# EAGLE design plaits_5u_rev2 (EAGLE 9.2.2)

## Sheet 1 of 5
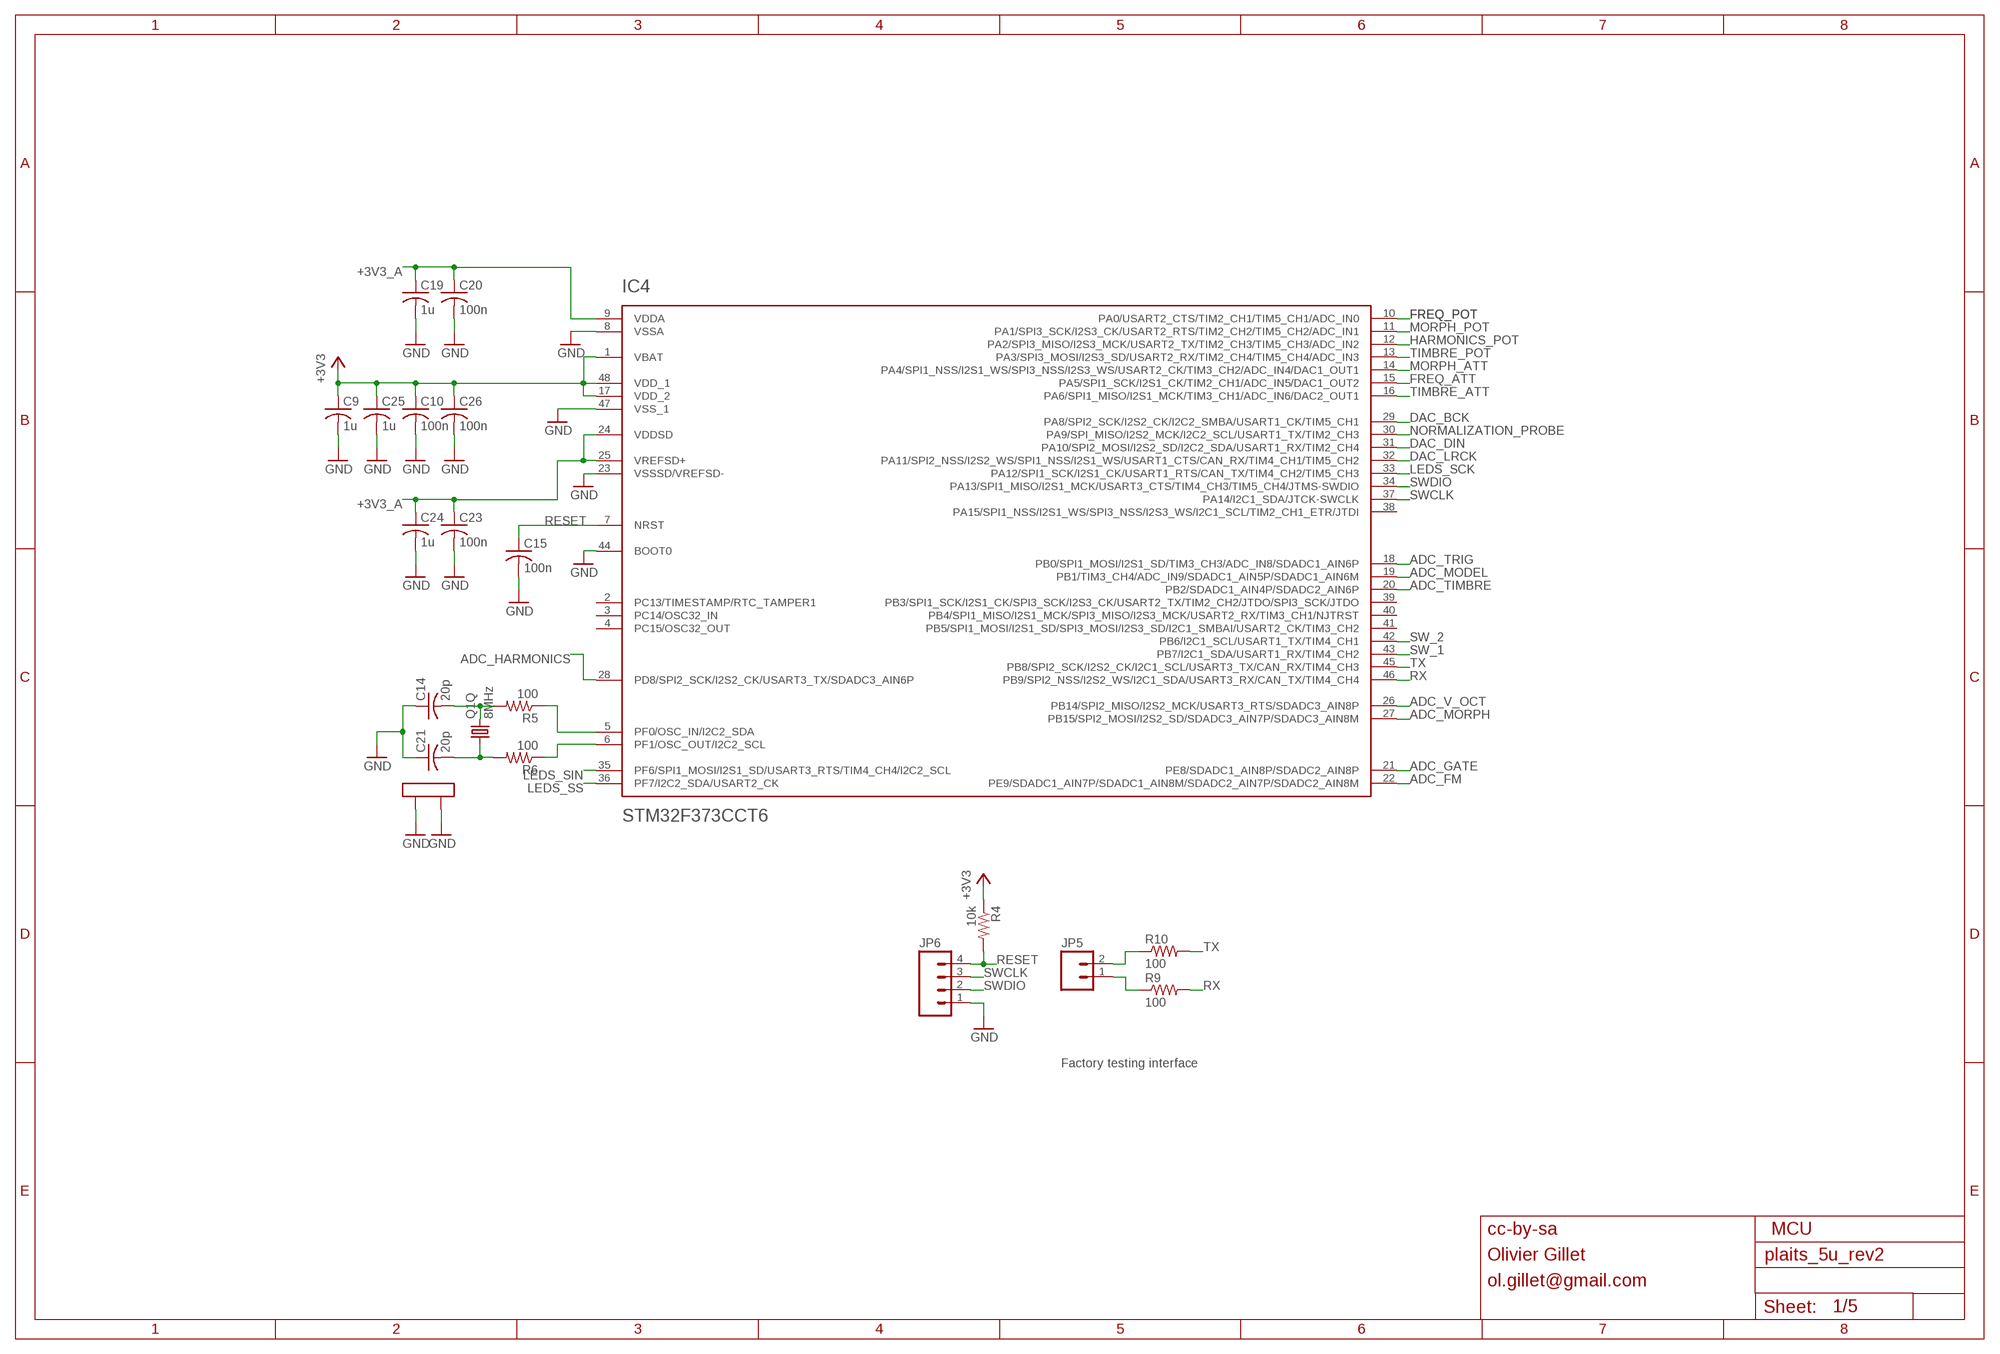
[diagram p0: schematic, sheet 1]

### Parts
C9  1u  C-USC0805  [C0805]
C10  100n  C-USC0805  [C0805]
C14  20p  C-USC0805  [C0805]
C15  100n  C-USC0805  [C0805]
C19  1u  C-USC0805  [C0805]
C20  100n  C-USC0805  [C0805]
C21  20p  C-USC0805  [C0805]
C23  100n  C-USC0805  [C0805]
C24  1u  C-USC0805  [C0805]
C25  1u  C-USC0805  [C0805]
C26  100n  C-USC0805  [C0805]
IC4  STM32F373CCT6  STM32F373C  [LQFP48]
JP5  M02PTH  [1X02]
JP6  M04PTH  [1X04]
Q1  8MHz  CRYSTAL  [CTS406]
R4  10k  R-US_R0805  [R0805]
R5  100  R-US_R0805  [R0805]
R6  100  R-US_R0805  [R0805]
R9  100  R-US_R0805  [R0805]
R10  100  R-US_R0805  [R0805]

### Nets
+3V3: C9.1 C10.1 C25.1 C26.1 IC4.1(VBAT) IC4.17(VDD_2) IC4.48(VDD_1) R4.1 ; also sheet 2,3,4,5
+3V3_A: C19.1 C20.1 C23.1 C24.1 IC4.9(VDDA) IC4.24(VDDSD) IC4.25(VREFSD+) ; also sheet 2,3,4,5
ADC_FM: IC4.22(PE9/SDADC1_AIN7P/SDADC1_AIN8M/SDADC2_AIN7P/SDADC2_AIN8M) ; also sheet 3
ADC_GATE: IC4.21(PE8/SDADC1_AIN8P/SDADC2_AIN8P) ; also sheet 3
ADC_HARMONICS: IC4.28(PD8/SPI2_SCK/I2S2_CK/USART3_TX/SDADC3_AIN6P) ; also sheet 3
ADC_MODEL: IC4.19(PB1/TIM3_CH4/ADC_IN9/SDADC1_AIN5P/SDADC1_AIN6M) ; also sheet 3
ADC_MORPH: IC4.27(PB15/SPI2_MOSI/I2S2_SD/SDADC3_AIN7P/SDADC3_AIN8M) ; also sheet 3
ADC_TIMBRE: IC4.20(PB2/SDADC1_AIN4P/SDADC2_AIN6P) ; also sheet 3
ADC_TRIG: IC4.18(PB0/SPI1_MOSI/I2S1_SD/TIM3_CH3/ADC_IN8/SDADC1_AIN6P) ; also sheet 3
ADC_V_OCT: IC4.26(PB14/SPI2_MISO/I2S2_MCK/USART3_RTS/SDADC3_AIN8P) ; also sheet 3
DAC_BCK: IC4.29(PA8/SPI2_SCK/I2S2_CK/I2C2_SMBA/USART1_CK/TIM5_CH1) ; also sheet 4
DAC_DIN: IC4.31(PA10/SPI2_MOSI/I2S2_SD/I2C2_SDA/USART1_RX/TIM2_CH4) ; also sheet 4
DAC_LRCK: IC4.32(PA11/SPI2_NSS/I2S2_WS/SPI1_NSS/I2S1_WS/USART1_CTS/CAN_RX/TIM4_CH1/TIM5_CH2) ; also sheet 4
FREQ_ATT: IC4.15(PA5/SPI1_SCK/I2S1_CK/TIM2_CH1/ADC_IN5/DAC1_OUT2) ; also sheet 2
FREQ_POT: IC4.10(PA0/USART2_CTS/TIM2_CH1/TIM5_CH1/ADC_IN0) ; also sheet 2
GND: C9.2 C10.2 C14.1 C15.2 C19.2 C20.2 C21.1 C23.2 C24.2 C25.2 C26.2 IC4.8(VSSA) IC4.23(VSSSD/VREFSD-) IC4.44(BOOT0) IC4.47(VSS_1) JP6.1 Q1.2(LID1) Q1.4(LID2) ; also sheet 2,3,4,5
HARMONICS_POT: IC4.12(PA2/SPI3_MISO/I2S3_MCK/USART2_TX/TIM2_CH3/TIM5_CH3/ADC_IN2) ; also sheet 2
LEDS_SCK: IC4.33(PA12/SPI1_SCK/I2S1_CK/USART1_RTS/CAN_TX/TIM4_CH2/TIM5_CH3) ; also sheet 2
LEDS_SIN: IC4.35(PF6/SPI1_MOSI/I2S1_SD/USART3_RTS/TIM4_CH4/I2C2_SCL) ; also sheet 2
LEDS_SS: IC4.36(PF7/I2C2_SDA/USART2_CK) ; also sheet 2
MORPH_ATT: IC4.14(PA4/SPI1_NSS/I2S1_WS/SPI3_NSS/I2S3_WS/USART2_CK/TIM3_CH2/ADC_IN4/DAC1_OUT1) ; also sheet 2
MORPH_POT: IC4.11(PA1/SPI3_SCK/I2S3_CK/USART2_RTS/TIM2_CH2/TIM5_CH2/ADC_IN1) ; also sheet 2
N$7: IC4.5(PF0/OSC_IN/I2C2_SDA) R5.1
N$8: IC4.6(PF1/OSC_OUT/I2C2_SCL) R6.1
N$29: C14.2 Q1.3 R5.2
N$33: JP5.2 R10.1
N$35: C21.2 Q1.1 R6.2
N$51: JP5.1 R9.1
NORMALIZATION_PROBE: IC4.30(PA9/SPI_MISO/I2S2_MCK/I2C2_SCL/USART1_TX/TIM2_CH3) ; also sheet 3
RESET: C15.1 IC4.7(NRST) JP6.4 R4.2
RX: IC4.46(PB9/SPI2_NSS/I2S2_WS/I2C1_SDA/USART3_RX/CAN_TX/TIM4_CH4) R9.2
SW_1: IC4.43(PB7/I2C1_SDA/USART1_RX/TIM4_CH2) ; also sheet 2
SW_2: IC4.42(PB6/I2C1_SCL/USART1_TX/TIM4_CH1) ; also sheet 2
SWCLK: IC4.37(PA14/I2C1_SDA/JTCK-SWCLK) JP6.3
SWDIO: IC4.34(PA13/SPI1_MISO/I2S1_MCK/USART3_CTS/TIM4_CH3/TIM5_CH4/JTMS-SWDIO) JP6.2
TIMBRE_ATT: IC4.16(PA6/SPI1_MISO/I2S1_MCK/TIM3_CH1/ADC_IN6/DAC2_OUT1) ; also sheet 2
TIMBRE_POT: IC4.13(PA3/SPI3_MOSI/I2S3_SD/USART2_RX/TIM2_CH4/TIM5_CH4/ADC_IN3) ; also sheet 2
TX: IC4.45(PB8/SPI2_SCK/I2S2_CK/I2C1_SCL/USART3_TX/CAN_RX/TIM4_CH3) R10.2
Unconnected: IC4.2(PC13/TIMESTAMP/RTC_TAMPER1) IC4.3(PC14/OSC32_IN) IC4.4(PC15/OSC32_OUT) IC4.38(PA15/SPI1_NSS/I2S1_WS/SPI3_NSS/I2S3_WS/I2C1_SCL/TIM2_CH1_ETR/JTDI) IC4.39(PB3/SPI1_SCK/I2S1_CK/SPI3_SCK/I2S3_CK/USART2_TX/TIM2_CH2/JTDO/SPI3_SCK/JTDO) IC4.40(PB4/SPI1_MISO/I2S1_MCK/SPI3_MISO/I2S3_MCK/USART2_RX/TIM3_CH1/NJTRST) IC4.41(PB5/SPI1_MOSI/I2S1_SD/SPI3_MOSI/I2S3_SD/I2C1_SMBAI/USART2_CK/TIM3_CH2)

### Notes on the sheet
- Factory testing interface
- cc-by-sa | MCU
- Olivier Gillet
- ol.gillet@gmail.com

## Sheet 2 of 5
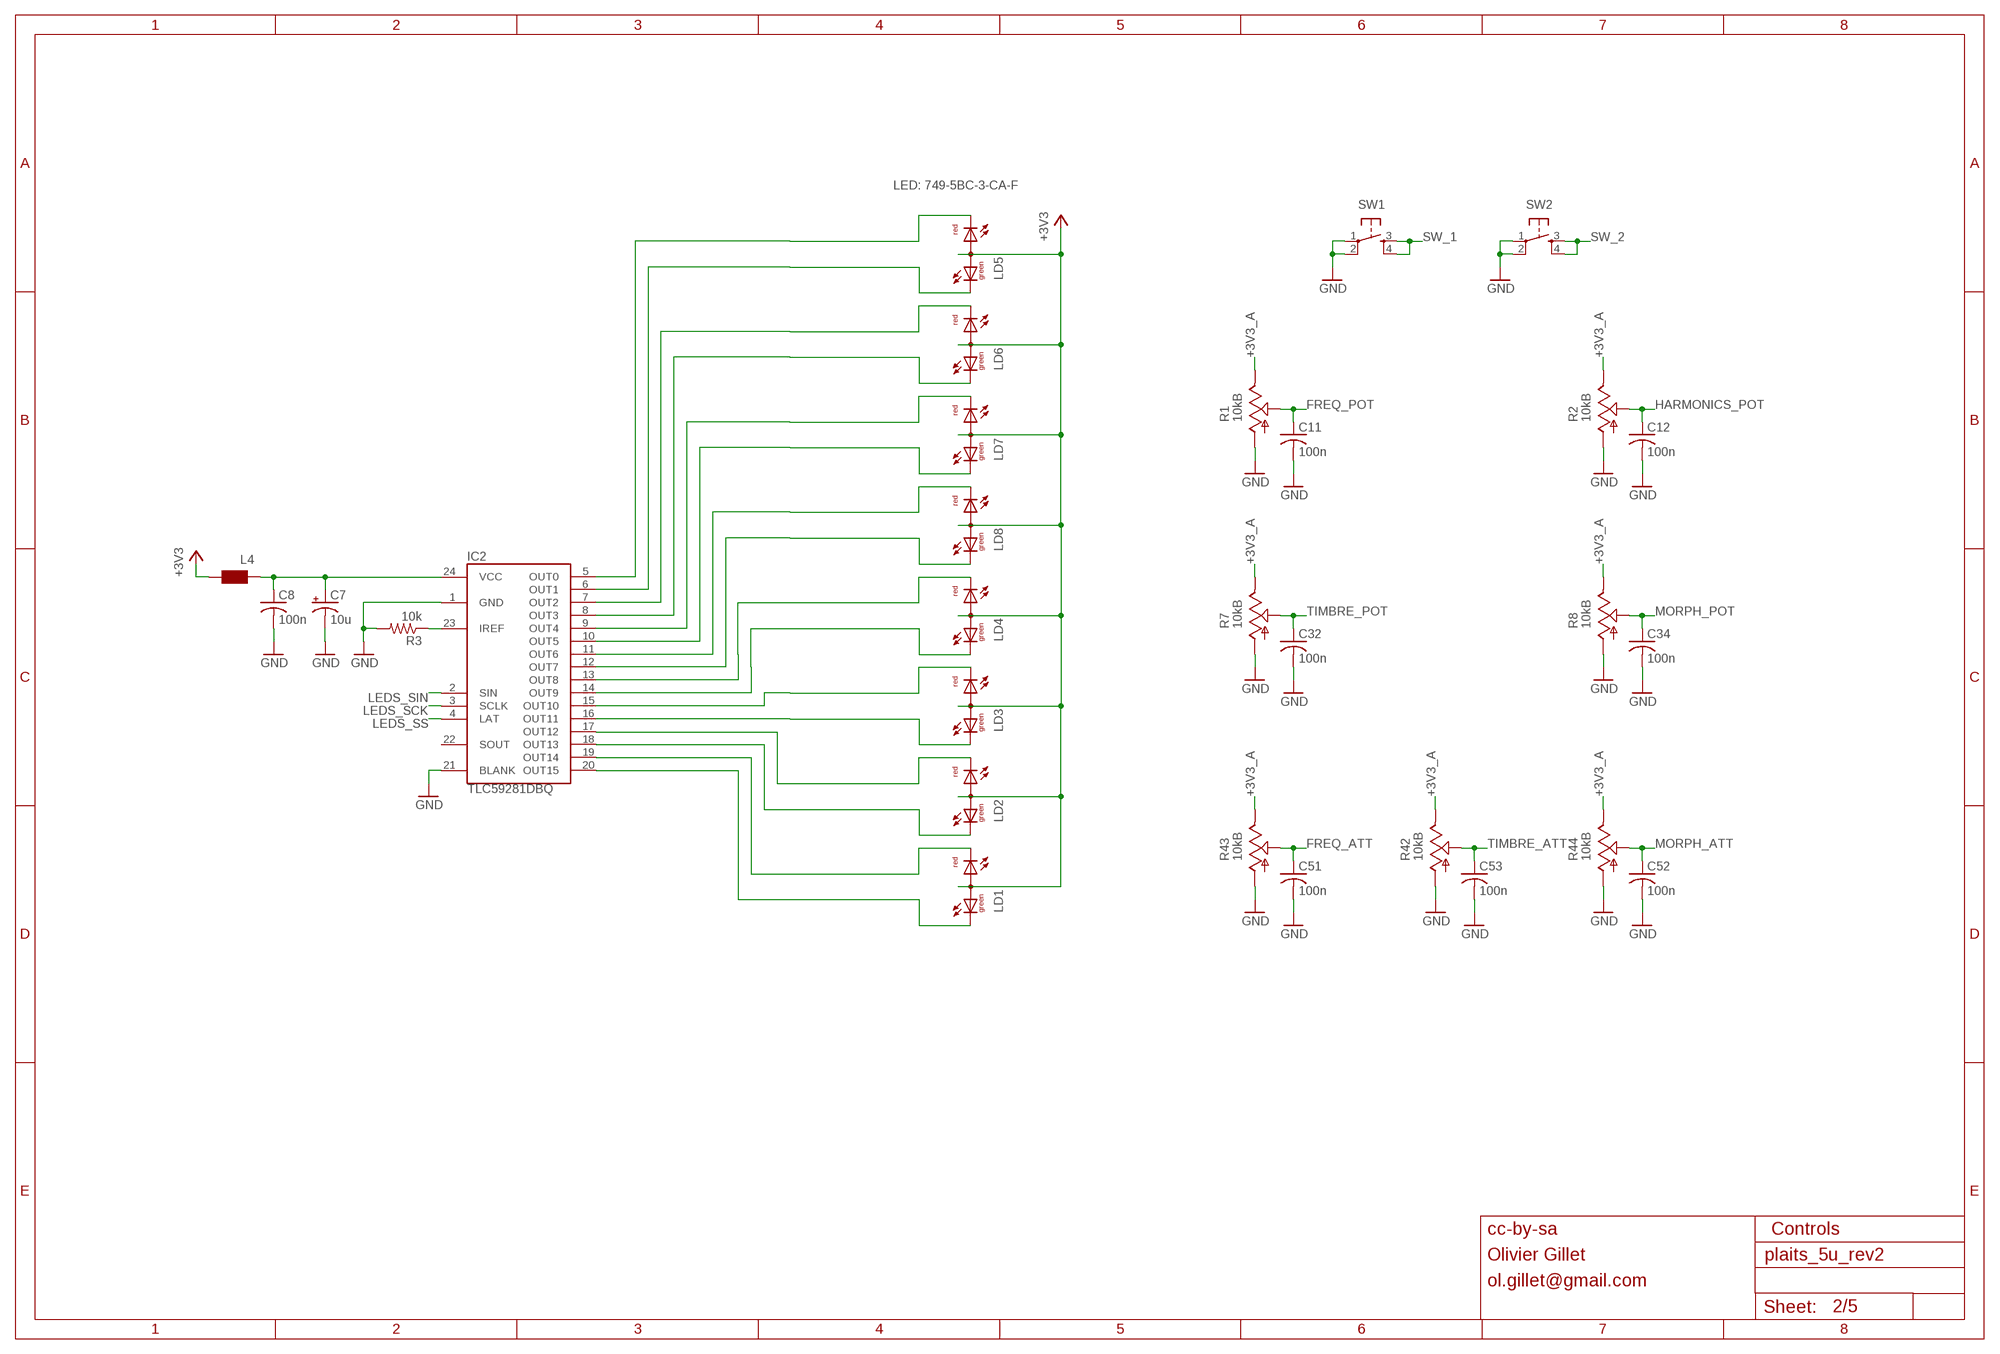
[diagram p1: schematic, sheet 2]

### Parts
C7  10u  CPOL-USA  [PANASONIC_A]
C8  100n  C-USC0805  [C0805]
C11  100n  C-USC0805  [C0805]
C12  100n  C-USC0805  [C0805]
C32  100n  C-USC0805  [C0805]
C34  100n  C-USC0805  [C0805]
C51  100n  C-USC0805  [C0805]
C52  100n  C-USC0805  [C0805]
C53  100n  C-USC0805  [C0805]
IC2  TLC59281DBQ  [TSSOP24_0635]
L4  WE-CBF_0805  [0805]
LD1  DUOLED-RG-A  [DUOLED-A-5MM]
LD2  DUOLED-RG-A  [DUOLED-A-5MM]
LD3  DUOLED-RG-A  [DUOLED-A-5MM]
LD4  DUOLED-RG-A  [DUOLED-A-5MM]
LD5  DUOLED-RG-A  [DUOLED-A-5MM]
LD6  DUOLED-RG-A  [DUOLED-A-5MM]
LD7  DUOLED-RG-A  [DUOLED-A-5MM]
LD8  DUOLED-RG-A  [DUOLED-A-5MM]
R1  10kB  POT_USVERTICAL_PS  [ALPS_POT_VERTICAL_PS]
R2  10kB  POT_USVERTICAL_PS  [ALPS_POT_VERTICAL_PS]
R3  10k  R-US_R0805  [R0805]
R7  10kB  POT_USVERTICAL_PS  [ALPS_POT_VERTICAL_PS]
R8  10kB  POT_USVERTICAL_PS  [ALPS_POT_VERTICAL_PS]
R42  10kB  POT_USVERTICAL  [ALPS_POT_VERTICAL]
R43  10kB  POT_USVERTICAL  [ALPS_POT_VERTICAL]
R44  10kB  POT_USVERTICAL  [ALPS_POT_VERTICAL]
SW1  TAC_SWITCHPTH  [TACTILE-PTH]
SW2  TAC_SWITCHPTH  [TACTILE-PTH]

### Nets
+3V3: L4.2 LD1.A LD2.A LD3.A LD4.A LD5.A LD6.A LD7.A LD8.A ; also sheet 1,3,4,5
+3V3_A: R1.P$1(E) R2.P$1(E) R7.P$1(E) R8.P$1(E) R42.P$1(E) R43.P$1(E) R44.P$1(E) ; also sheet 1,3,4,5
FREQ_ATT: C51.1 R43.P$2(S) ; also sheet 1
FREQ_POT: C11.1 R1.P$2(S) ; also sheet 1
GND: C7.- C8.2 C11.2 C12.2 C32.2 C34.2 C51.2 C52.2 C53.2 IC2.1(GND) IC2.21(BLANK) R1.P$3(A) R2.P$3(A) R3.2 R7.P$3(A) R8.P$3(A) R42.P$3(A) R43.P$3(A) R44.P$3(A) SW1.1 SW1.2 SW2.1 SW2.2 ; also sheet 1,3,4,5
HARMONICS_POT: C12.1 R2.P$2(S) ; also sheet 1
LEDS_SCK: IC2.3(SCLK) ; also sheet 1
LEDS_SIN: IC2.2(SIN) ; also sheet 1
LEDS_SS: IC2.4(LAT) ; also sheet 1
MORPH_ATT: C52.1 R44.P$2(S) ; also sheet 1
MORPH_POT: C34.1 R8.P$2(S) ; also sheet 1
N$2: IC2.12(OUT7) LD8.CX(CG)
N$5: IC2.11(OUT6) LD8.CR
N$9: IC2.10(OUT5) LD7.CX(CG)
N$10: IC2.9(OUT4) LD7.CR
N$11: IC2.8(OUT3) LD6.CX(CG)
N$12: IC2.13(OUT8) LD4.CR
N$13: IC2.7(OUT2) LD6.CR
N$14: IC2.14(OUT9) LD4.CX(CG)
N$15: IC2.6(OUT1) LD5.CX(CG)
N$17: IC2.15(OUT10) LD3.CR
N$18: IC2.16(OUT11) LD3.CX(CG)
N$19: IC2.17(OUT12) LD2.CR
N$20: IC2.18(OUT13) LD2.CX(CG)
N$21: IC2.19(OUT14) LD1.CR
N$22: IC2.5(OUT0) LD5.CR
N$23: IC2.20(OUT15) LD1.CX(CG)
N$27: C7.+ C8.1 IC2.24(VCC) L4.1
N$68: IC2.23(IREF) R3.1
SW_1: SW1.3 SW1.4 ; also sheet 1
SW_2: SW2.3 SW2.4 ; also sheet 1
TIMBRE_ATT: C53.1 R42.P$2(S) ; also sheet 1
TIMBRE_POT: C32.1 R7.P$2(S) ; also sheet 1
Unconnected: IC2.22(SOUT)

### Notes on the sheet
- LED: 749-5BC-3-CA-F
- cc-by-sa | Controls
- Olivier Gillet
- ol.gillet@gmail.com

## Sheet 3 of 5
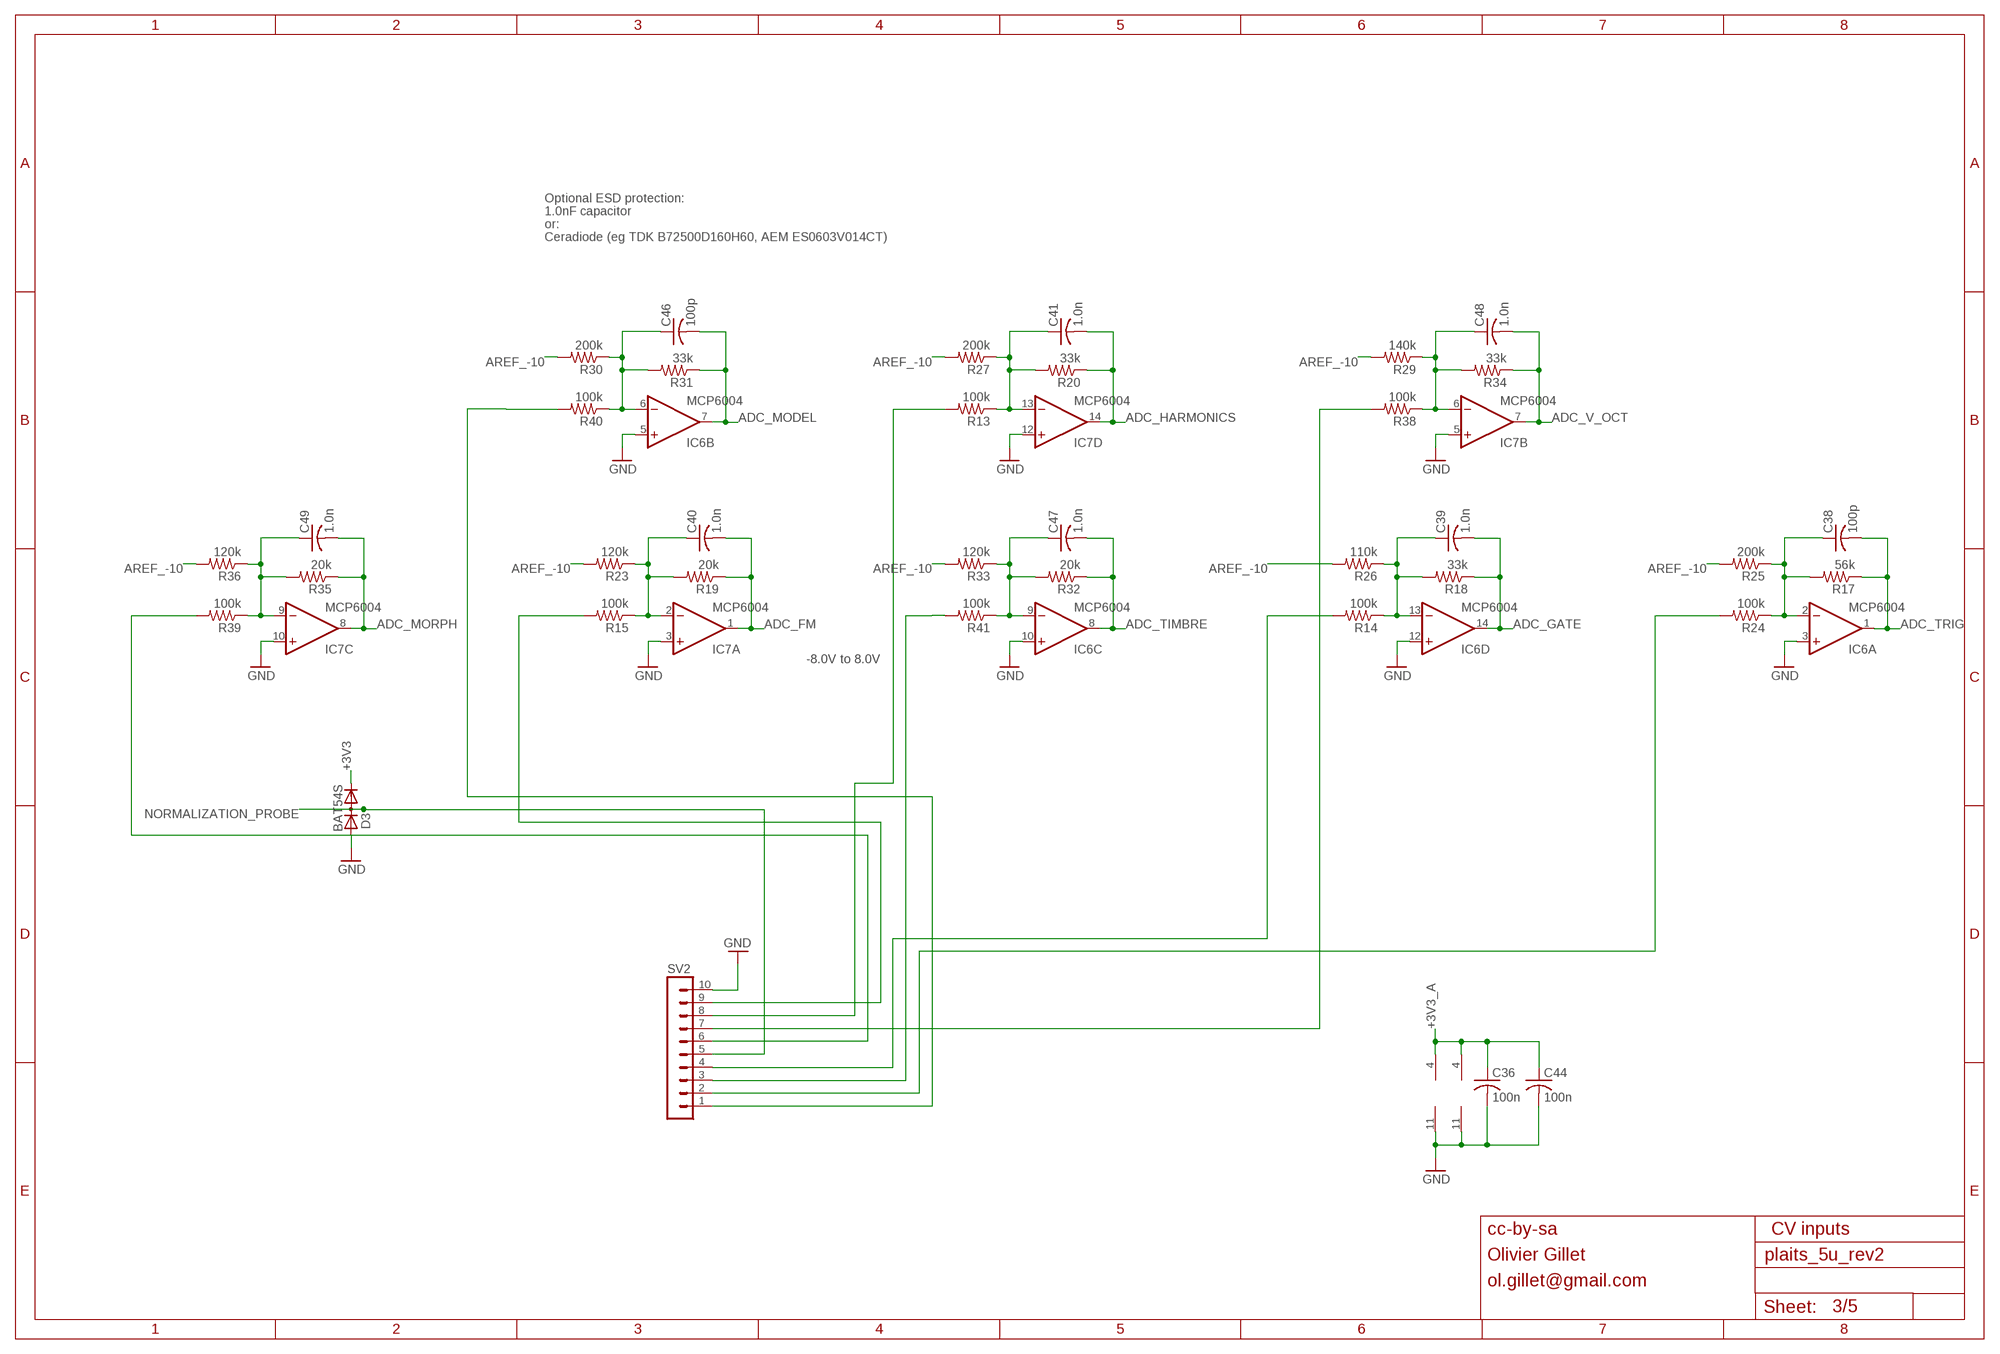
[diagram p2: schematic, sheet 3]

### Parts
C36  100n  C-USC0805  [C0805]
C38  100p  C-USC0805  [C0805]
C39  1.0n  C-USC0805  [C0805]
C40  1.0n  C-USC0805  [C0805]
C41  1.0n  C-USC0805  [C0805]
C44  100n  C-USC0805  [C0805]
C46  100p  C-USC0805  [C0805]
C47  1.0n  C-USC0805  [C0805]
C48  1.0n  C-USC0805  [C0805]
C49  1.0n  C-USC0805  [C0805]
D3  BAT54S  DIODE_2CACA-SOT23  [SOT23]
IC6  MCP6004  TL074D  [SO14]
IC7  MCP6004  TL074D  [SO14]
R13  100k  R-US_R0805  [R0805]
R14  100k  R-US_R0805  [R0805]
R15  100k  R-US_R0805  [R0805]
R17  56k  R-US_R0805  [R0805]
R18  33k  R-US_R0805  [R0805]
R19  20k  R-US_R0805  [R0805]
R20  33k  R-US_R0805  [R0805]
R23  120k  R-US_R0805  [R0805]
R24  100k  R-US_R0805  [R0805]
R25  200k  R-US_R0805  [R0805]
R26  110k  R-US_R0805  [R0805]
R27  200k  R-US_R0805  [R0805]
R29  140k  R-US_R0805  [R0805]
R30  200k  R-US_R0805  [R0805]
R31  33k  R-US_R0805  [R0805]
R32  20k  R-US_R0805  [R0805]
R33  120k  R-US_R0805  [R0805]
R34  33k  R-US_R0805  [R0805]
R35  20k  R-US_R0805  [R0805]
R36  120k  R-US_R0805  [R0805]
R38  100k  R-US_R0805  [R0805]
R39  100k  R-US_R0805  [R0805]
R40  100k  R-US_R0805  [R0805]
R41  100k  R-US_R0805  [R0805]
SV2  MA10-1  [MA10-1]

### Nets
+3V3: D3.2(C) ; also sheet 1,2,4,5
+3V3_A: C36.1 C44.1 IC6.4(P:V+) IC7.4(P:V+) ; also sheet 1,2,4,5
ADC_FM: C40.2 IC7.1(A:OUT) R19.1 ; also sheet 1
ADC_GATE: C39.2 IC6.14(D:OUT) R18.1 ; also sheet 1
ADC_HARMONICS: C41.2 IC7.14(D:OUT) R20.1 ; also sheet 1
ADC_MODEL: C46.2 IC6.7(B:OUT) R31.1 ; also sheet 1
ADC_MORPH: C49.2 IC7.8(C:OUT) R35.1 ; also sheet 1
ADC_TIMBRE: C47.2 IC6.8(C:OUT) R32.1 ; also sheet 1
ADC_TRIG: C38.2 IC6.1(A:OUT) R17.1 ; also sheet 1
ADC_V_OCT: C48.2 IC7.7(B:OUT) R34.1 ; also sheet 1
AREF_-10: R23.2 R25.2 R26.2 R27.2 R29.2 R30.2 R33.2 R36.2 ; also sheet 5
FM_IN: R15.2 SV2.9
GATE_IN: R14.2 SV2.4
GATE_IN1: R24.2 SV2.2
GND: C36.2 C44.2 D3.1(A) IC6.3(A:+IN) IC6.5(B:+IN) IC6.10(C:+IN) IC6.11(P:V-) IC6.12(D:+IN) IC7.3(A:+IN) IC7.5(B:+IN) IC7.10(C:+IN) IC7.11(P:V-) IC7.12(D:+IN) SV2.10 ; also sheet 1,2,4,5
HARMONICS_IN: R13.2 SV2.8
MODEL_IN: R40.2 SV2.1
MORPH_IN: R39.2 SV2.6
N$4: C38.1 IC6.2(A:-IN) R17.2 R24.1 R25.1
N$28: C39.1 IC6.13(D:-IN) R14.1 R18.2 R26.1
N$30: C48.1 IC7.6(B:-IN) R29.1 R34.2 R38.1
N$31: R41.2 SV2.3
N$32: C49.1 IC7.9(C:-IN) R35.2 R36.1 R39.1
N$34: C40.1 IC7.2(A:-IN) R15.1 R19.2 R23.1
N$37: C46.1 IC6.6(B:-IN) R30.1 R31.2 R40.1
N$39: C47.1 IC6.9(C:-IN) R32.2 R33.1 R41.1
N$41: C41.1 IC7.13(D:-IN) R13.1 R20.2 R27.1
NORMALIZATION_PROBE: D3.3(AC) SV2.5 ; also sheet 1
V_OCT_IN: R38.2 SV2.7

### Notes on the sheet
- Optional ESD protection:
- 1.0nF capacitor
- or:
- Ceradiode (eg TDK B72500D160H60, AEM ES0603V014CT)
- -8.0V to 8.0V
- cc-by-sa | CV inputs
- Olivier Gillet
- ol.gillet@gmail.com

## Sheet 4 of 5
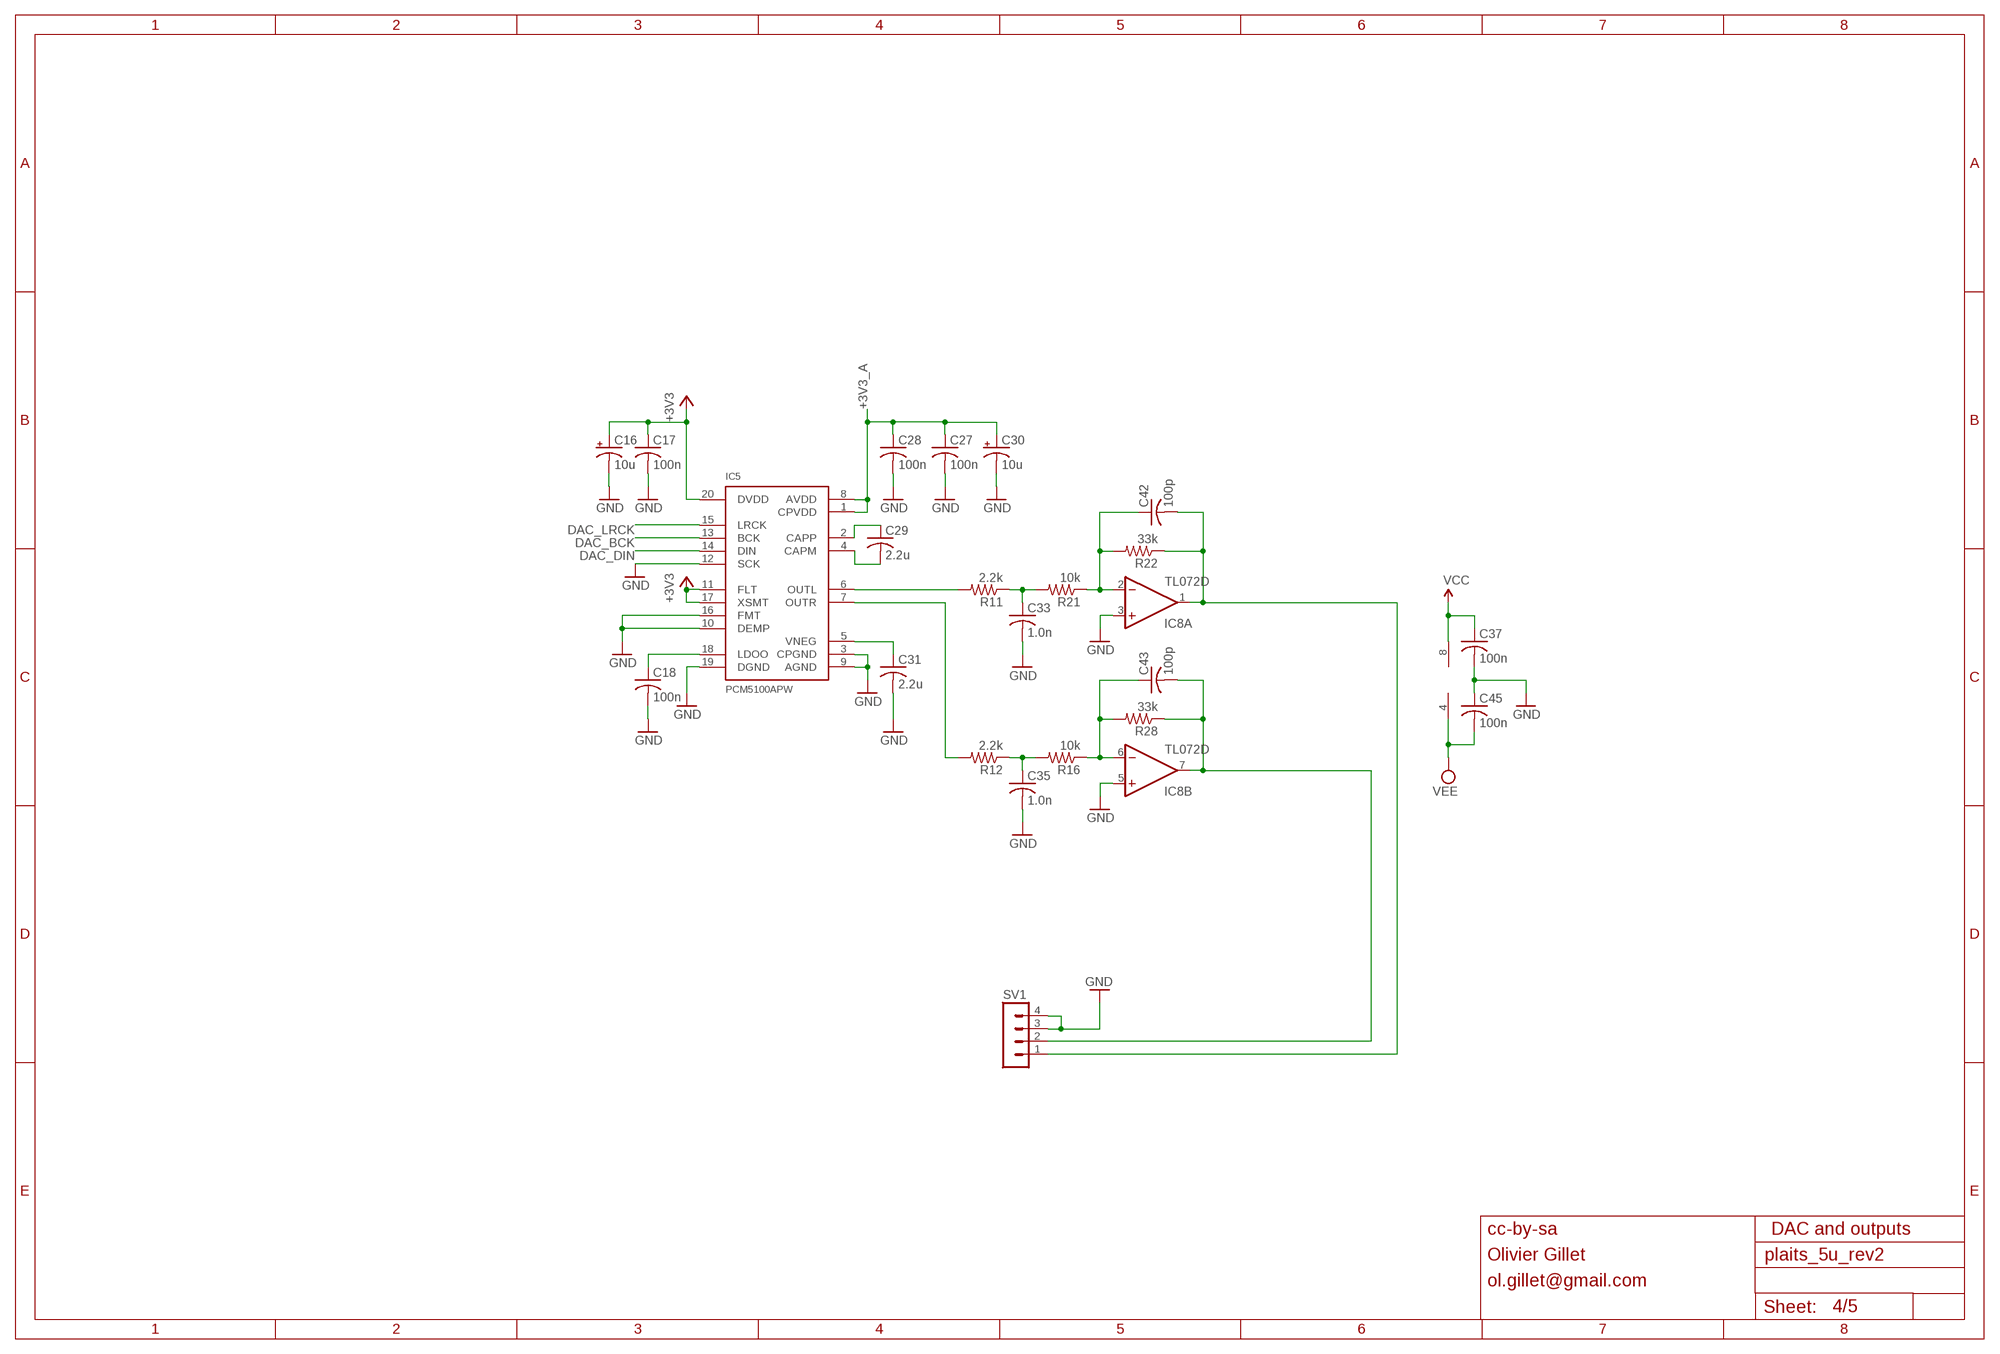
[diagram p3: schematic, sheet 4]

### Parts
C16  10u  CPOL-USA  [PANASONIC_A]
C17  100n  C-USC0805  [C0805]
C18  100n  C-USC0805  [C0805]
C27  100n  C-USC0805  [C0805]
C28  100n  C-USC0805  [C0805]
C29  2.2u  C-USC0805  [C0805]
C30  10u  CPOL-USA  [PANASONIC_A]
C31  2.2u  C-USC0805  [C0805]
C33  1.0n  C-USC0805  [C0805]
C35  1.0n  C-USC0805  [C0805]
C37  100n  C-USC0805  [C0805]
C42  100p  C-USC0805  [C0805]
C43  100p  C-USC0805  [C0805]
C45  100n  C-USC0805  [C0805]
IC5  PCM5100APW  PCM5100PW  [SSOP20]
IC8  TL072D  [SO08]
R11  2.2k  R-US_R0805  [R0805]
R12  2.2k  R-US_R0805  [R0805]
R16  10k  R-US_R0805  [R0805]
R21  10k  R-US_R0805  [R0805]
R22  33k  R-US_R0805  [R0805]
R28  33k  R-US_R0805  [R0805]
SV1  MA04-1  [MA04-1]

### Nets
+3V3: C16.+ C17.1 IC5.11(FLT) IC5.17(XSMT) IC5.20(DVDD) ; also sheet 1,2,3,5
+3V3_A: C27.1 C28.1 C30.+ IC5.1(CPVDD) IC5.8(AVDD) ; also sheet 1,2,3,5
DAC_BCK: IC5.13(BCK) ; also sheet 1
DAC_DIN: IC5.14(DIN) ; also sheet 1
DAC_LRCK: IC5.15(LRCK) ; also sheet 1
GND: C16.- C17.2 C18.2 C27.2 C28.2 C30.- C31.2 C33.2 C35.2 C37.2 C45.1 IC5.3(CPGND) IC5.9(AGND) IC5.10(DEMP) IC5.12(SCK) IC5.16(FMT) IC5.19(DGND) IC8.3(A:+IN) IC8.5(B:+IN) SV1.3 SV1.4 ; also sheet 1,2,3,5
N$6: C29.1 IC5.2(CAPP)
N$16: C29.2 IC5.4(CAPM)
N$43: IC5.6(OUTL) R11.2
N$46: C33.1 R11.1 R21.2
N$47: C35.1 R12.1 R16.2
N$48: C31.1 IC5.5(VNEG)
N$54: C18.1 IC5.18(LDOO)
N$55: IC5.7(OUTR) R12.2
N$58: C43.1 IC8.6(B:-IN) R16.1 R28.2
N$60: C43.2 IC8.7(B:OUT) R28.1 SV1.2
N$62: C42.1 IC8.2(A:-IN) R21.1 R22.2
N$63: C42.2 IC8.1(A:OUT) R22.1 SV1.1
VCC: C37.1 IC8.8(P:V+) ; also sheet 5
VEE: C45.2 IC8.4(P:V-) ; also sheet 5

### Notes on the sheet
- cc-by-sa | DAC and outputs
- Olivier Gillet
- ol.gillet@gmail.com

## Sheet 5 of 5
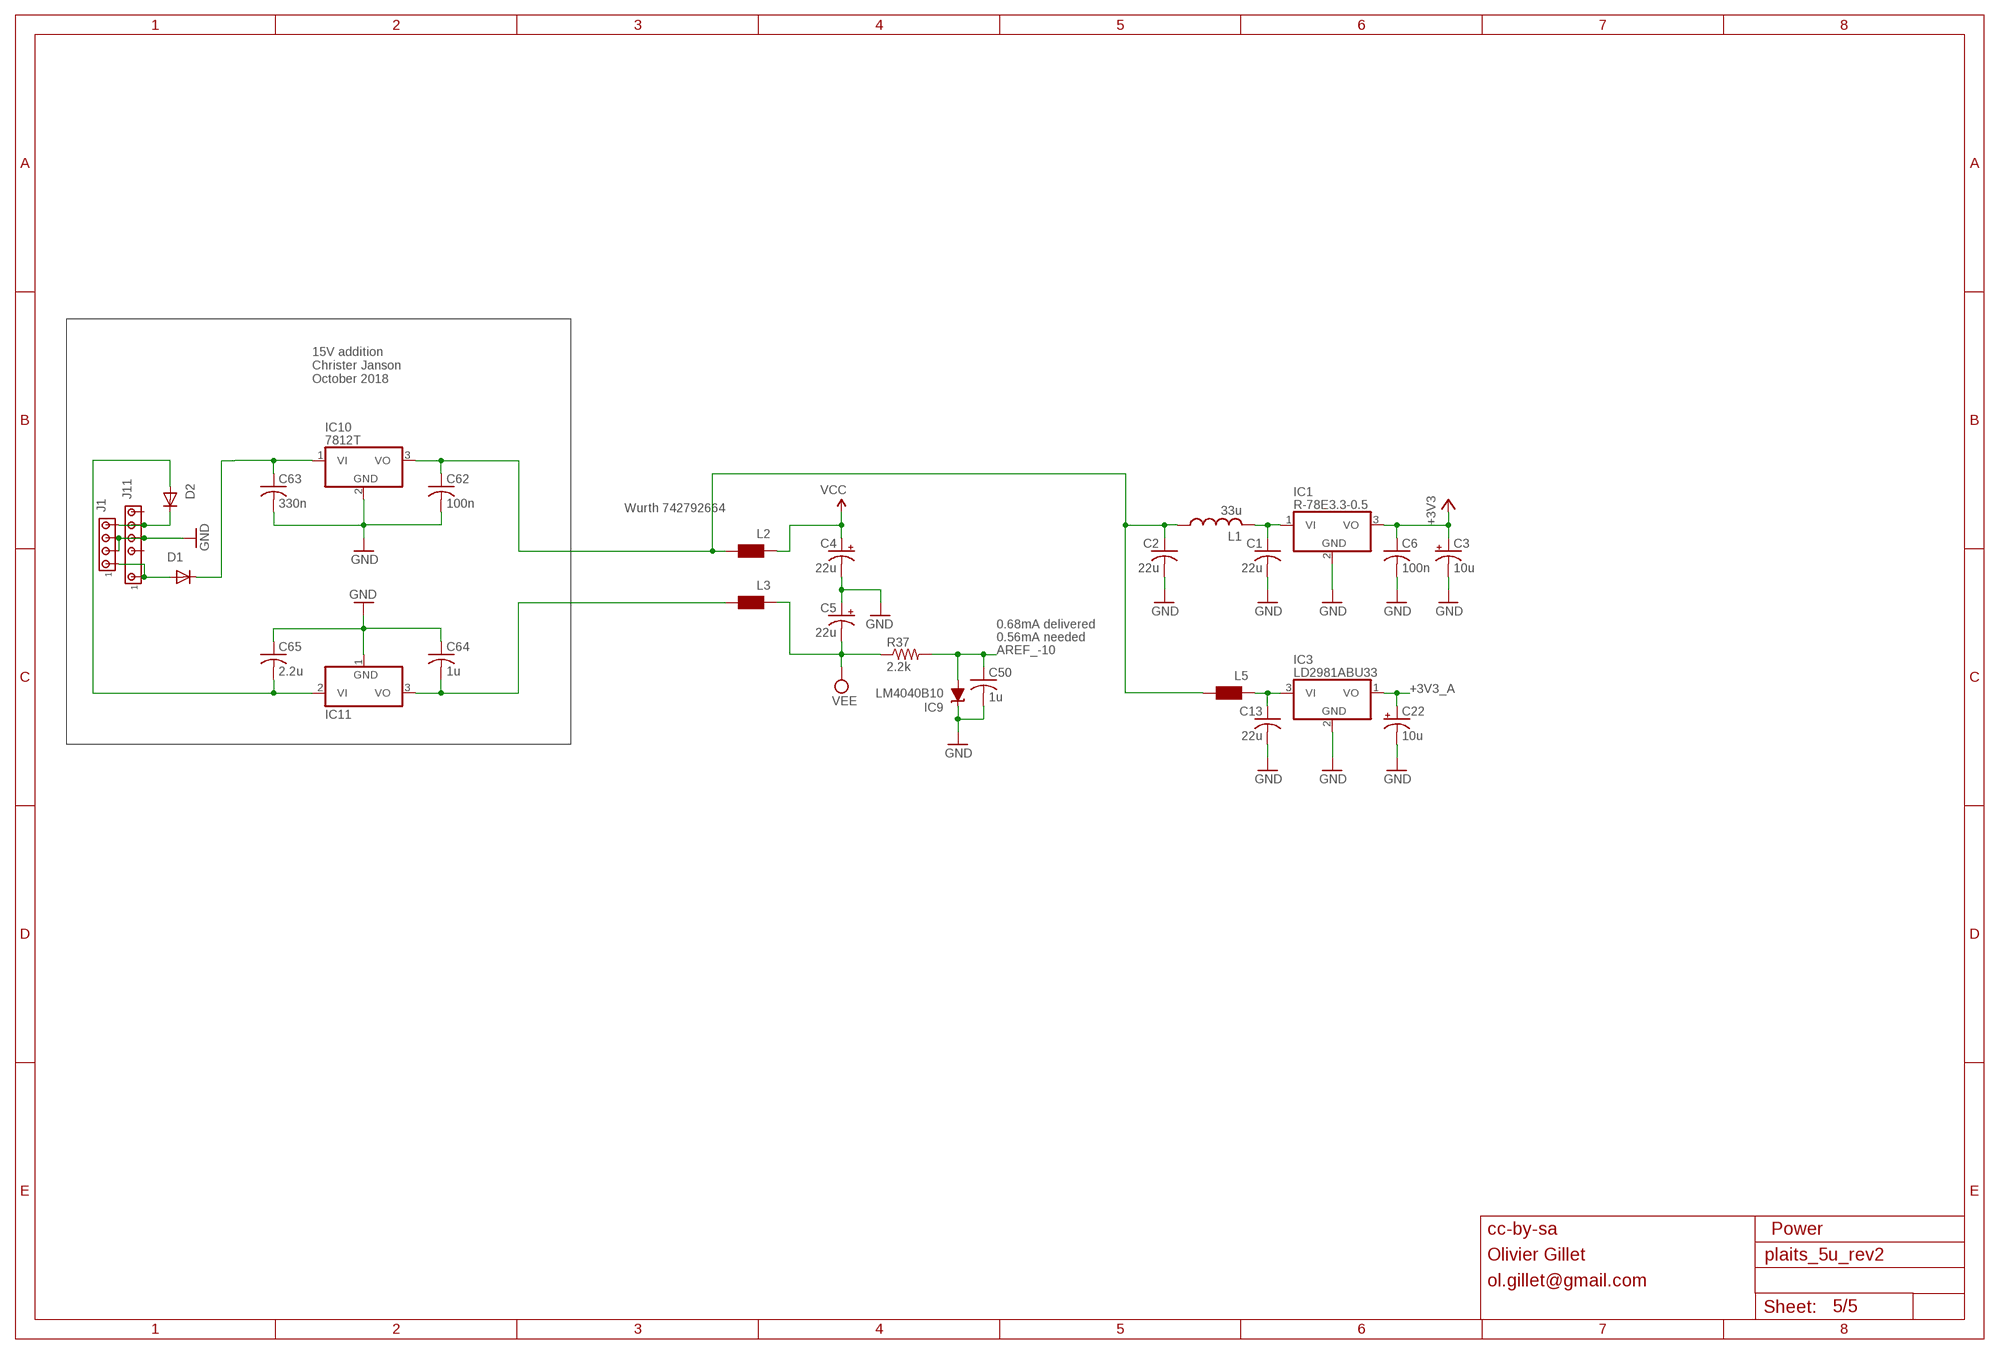
[diagram p4: schematic, sheet 5]

### Parts
C1  22u  C-USC1206  [C1206]
C2  22u  C-USC1206  [C1206]
C3  10u  CPOL-USA  [PANASONIC_A]
C4  22u  CPOL-USB  [PANASONIC_B]
C5  22u  CPOL-USB  [PANASONIC_B]
C6  100n  C-USC0805  [C0805]
C13  22u  C-USC1206  [C1206]
C22  10u  CPOL-USA  [PANASONIC_A]
C50  1u  C-USC0805  [C0805]
C62  100n  C-USC0805  [C0805]
C63  330n  C-USC0805  [C0805]
C64  1u  C-USC0805  [C0805]
C65  2.2u  C-USC0805  [C0805]
D1  1N5819HW  DIODE-SOD123  [SOD123]
D2  1N5819HW  DIODE-SOD123  [SOD123]
IC1  R-78E3.3-0.5  WE173950378  [WE78]
IC3  LD2981ABU33  LD2981ABU  [SOT89]
IC9  LM4040B10  LM4041B12DBZ  [DBZ_R-PDSO-G3]
IC10  7812T  [TO220H]
IC11  7912T  [TO220H]
J1  MTA04-156  [1X4MTA]
J11  DOTCOMPOWER  [DOTCOMPOWER]
L1  33u  L-USL2012C  [L2012C]
L2  WE-CBF_0805  [0805]
L3  WE-CBF_0805  [0805]
L5  WE-CBF_0805  [0805]
R37  2.2k  R-US_R0805  [R0805]

### Nets
+3V3: C3.+ C6.1 IC1.3(VO) ; also sheet 1,2,3,4
+3V3_A: C22.+ IC3.1(VO) ; also sheet 1,2,3,4
AREF_-10: C50.1 IC9.2(A) R37.2 ; also sheet 3
GND: C1.2 C2.2 C3.- C4.- C5.+ C6.2 C13.2 C22.- C50.2 C62.2 C63.2 C64.1 C65.1 IC1.2(GND) IC3.2(GND) IC9.1(C) IC10.2(GND) IC11.1(GND) J1.2 J1.3 J11.4 ; also sheet 1,2,3,4
N$1: C1.1 IC1.1(VI) L1.2
N$38: D2.C J1.4 J11.5
N$40: C64.2 IC11.3(VO) L3.2
N$42: C13.1 IC3.3(VI) L5.1
N$44: C2.1 C62.1 IC10.3(VO) L1.1 L2.2 L5.2
N$45: C63.1 D1.C IC10.1(VI)
N$49: D1.A J1.1 J11.1
N$50: C65.2 D2.A IC11.2(VI)
VCC: C4.+ L2.1 ; also sheet 4
VEE: C5.- L3.1 R37.1 ; also sheet 4
Unconnected: J11.3 J11.6

### Notes on the sheet
- 15V addition
  Christer Janson
  October 2018
- Wurth 742792664
- 0.68mA delivered
- 0.56mA needed
- cc-by-sa | Power
- Olivier Gillet
- ol.gillet@gmail.com

## Library data of the parts
C1 C2 C6 C8-C15 C17-C21 C23-C29 C31-C53 C62-C65 = rcl:C-US: CAPACITOR, American symbol
C3-C5 C7 C16 C22 C30 = rcl:CPOL-US: POLARIZED CAPACITOR, American symbol
D1 D2 = diode:DIODE-: DIODE
D3 = diode:DIODE_2CACA-: 2 Diodes - Cathode-Anode|Cathode-Anode
IC1 = og-vreg:WE173950378
IC2 = og-ics:TLC59281
IC3 = og-vreg:LD2981
IC4 = og-stm32f2:STM32F373C
IC5 = og-dac:PCM5100
IC6 IC7 = og-linear:TL074: OP AMP
IC8 = og-linear:TL072: OP AMP
IC9 = texas:LM4041: PRECISION MICROPOWER SHUNT VOLTAGE REFERENCE Source: http://focus.ti.com/lit/ds/slcs146e/slcs146e.pdf
IC10 = gm-regulators:78*: Positive VOLTAGE REGULATOR Source: http://cache.national.com/ds/LM/LM78L05.pdf http://www.fairchildsemi.com/ds/LM/LM7805.pdf
IC11 = linear:79*: Negative VOLTAGE REGULATOR
J1 = con-amp:MTA04-156: AMP connector
J11 = chrutil:DOTCOMPOWER: AMP connector Connection corrected 2014-09-19
JP5 = SparkFun:M02: Header 2 Standard 2-pin 0.1" header. Use with straight break away headers (SKU : PRT-00116), right angle break away headers (PRT-00553), swiss pins (PRT-00743), machine pins (PRT-00117), and female headers (PRT-00115). Molex polarized connector foot print use with SKU : PRT-08233 with associated crimp pins and housings.
JP6 = SparkFun:M04: Header 4 Standard 4-pin 0.1" header. Use with straight break away headers (SKU : PRT-00116), right angle break away headers (PRT-00553), swiss pins (PRT-00743), machine pins (PRT-00117), and female headers (PRT-00115). Molex polarized connector foot print use with SKU : PRT-08231 with associated crimp pins and housings.
L1 = og-rcl:L-US
L2-L5 = wuerth-elektronik:WE-CBF: SMD EMI Suppression Ferrite Beads - excellent anti-EMI properties - low DCR - impedances till 3000 ohms - rated current up to 6 A
LD1-LD8 = led:DUOLED-RG-A: DUO LED 2 colors (red/green), 5 mm, round, common Anode www.ligitek.com or other producers.
Q1 = og-crystal:CRYSTAL: Crystal with 2 extra terminals for the metal LID (Abracon ABMM2 for example)
R1 R2 R7 R8 R42-R44 = og-pots:POT_US
R3-R6 R9-R41 = rcl:R-US_: RESISTOR, American symbol
SV1 = con-lstb:MA04-1: PIN HEADER; OC_FARNELL: unknown; OC_NEWARK: unknown
SV2 = con-lstb:MA10-1: PIN HEADER; OC_FARNELL: unknown; OC_NEWARK: unknown
SW1 SW2 = SparkFun:TAC_SWITCH: Momentary Switch Button commonly used for reset or general input. Spark Fun Electronics SKU : COM-00097

## Net classes
0 default: width 0.254 mm

## Board
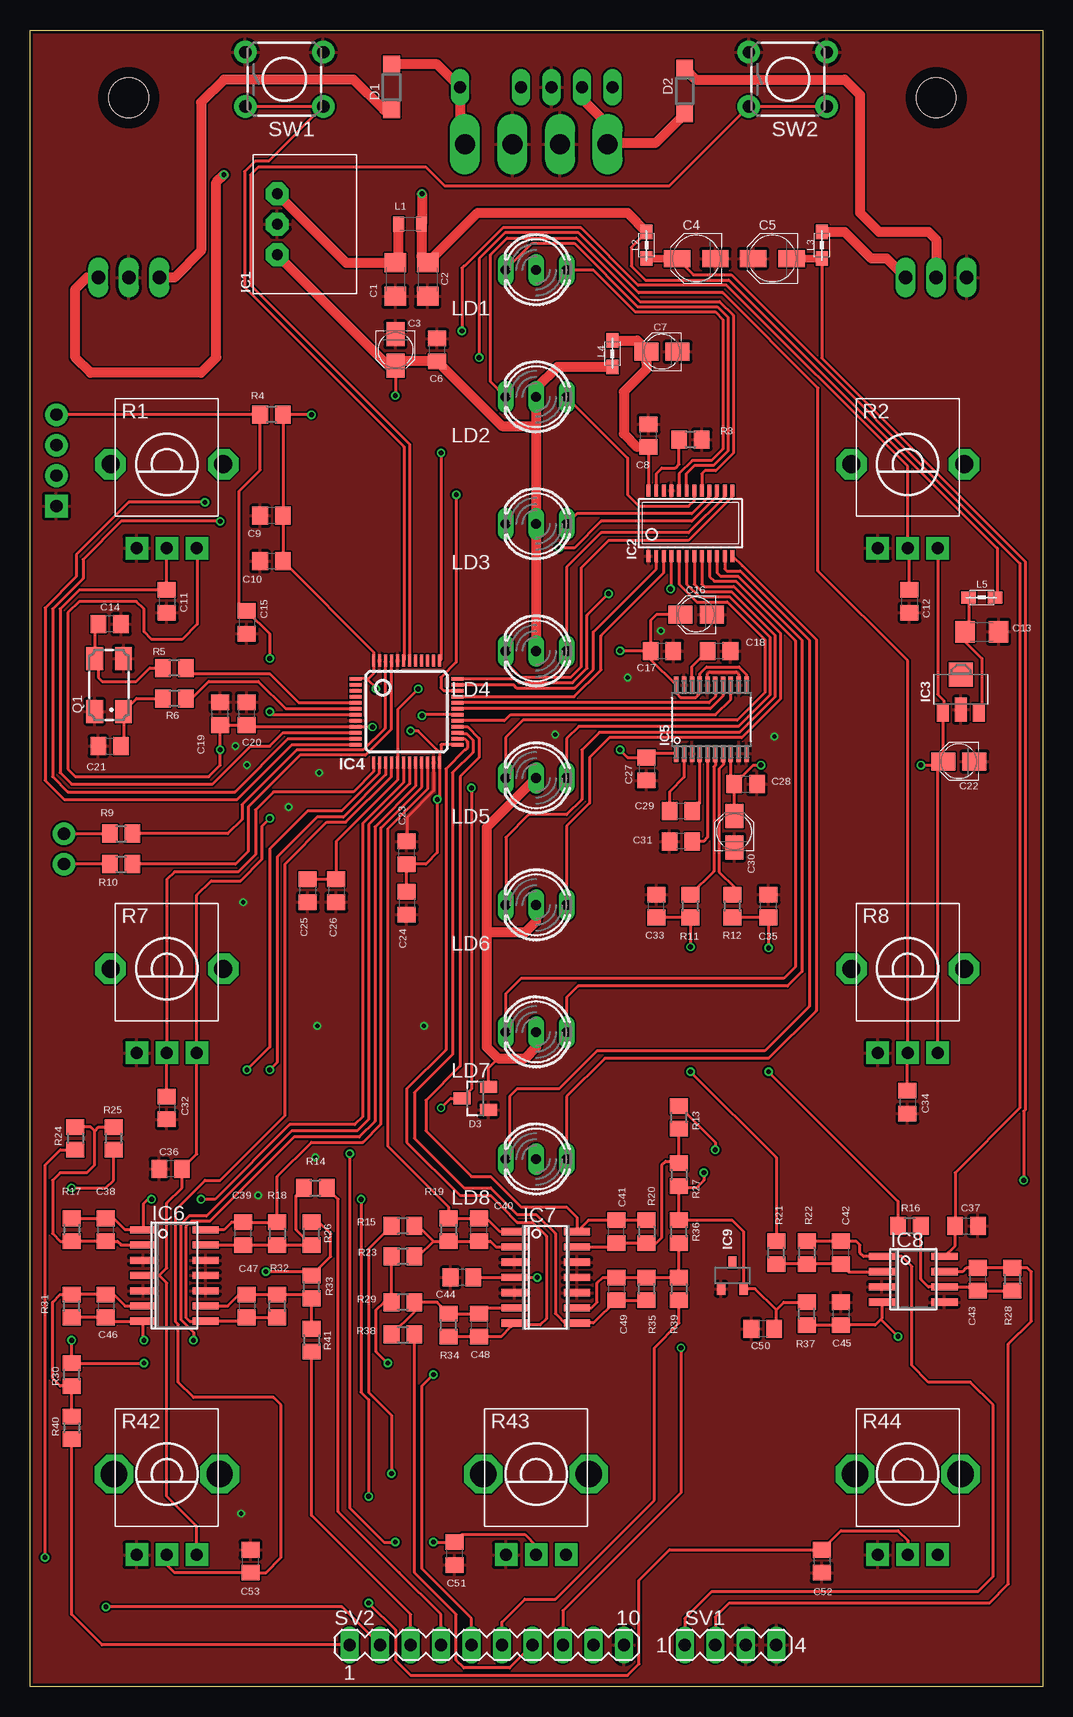
[diagram p5: board, top side]
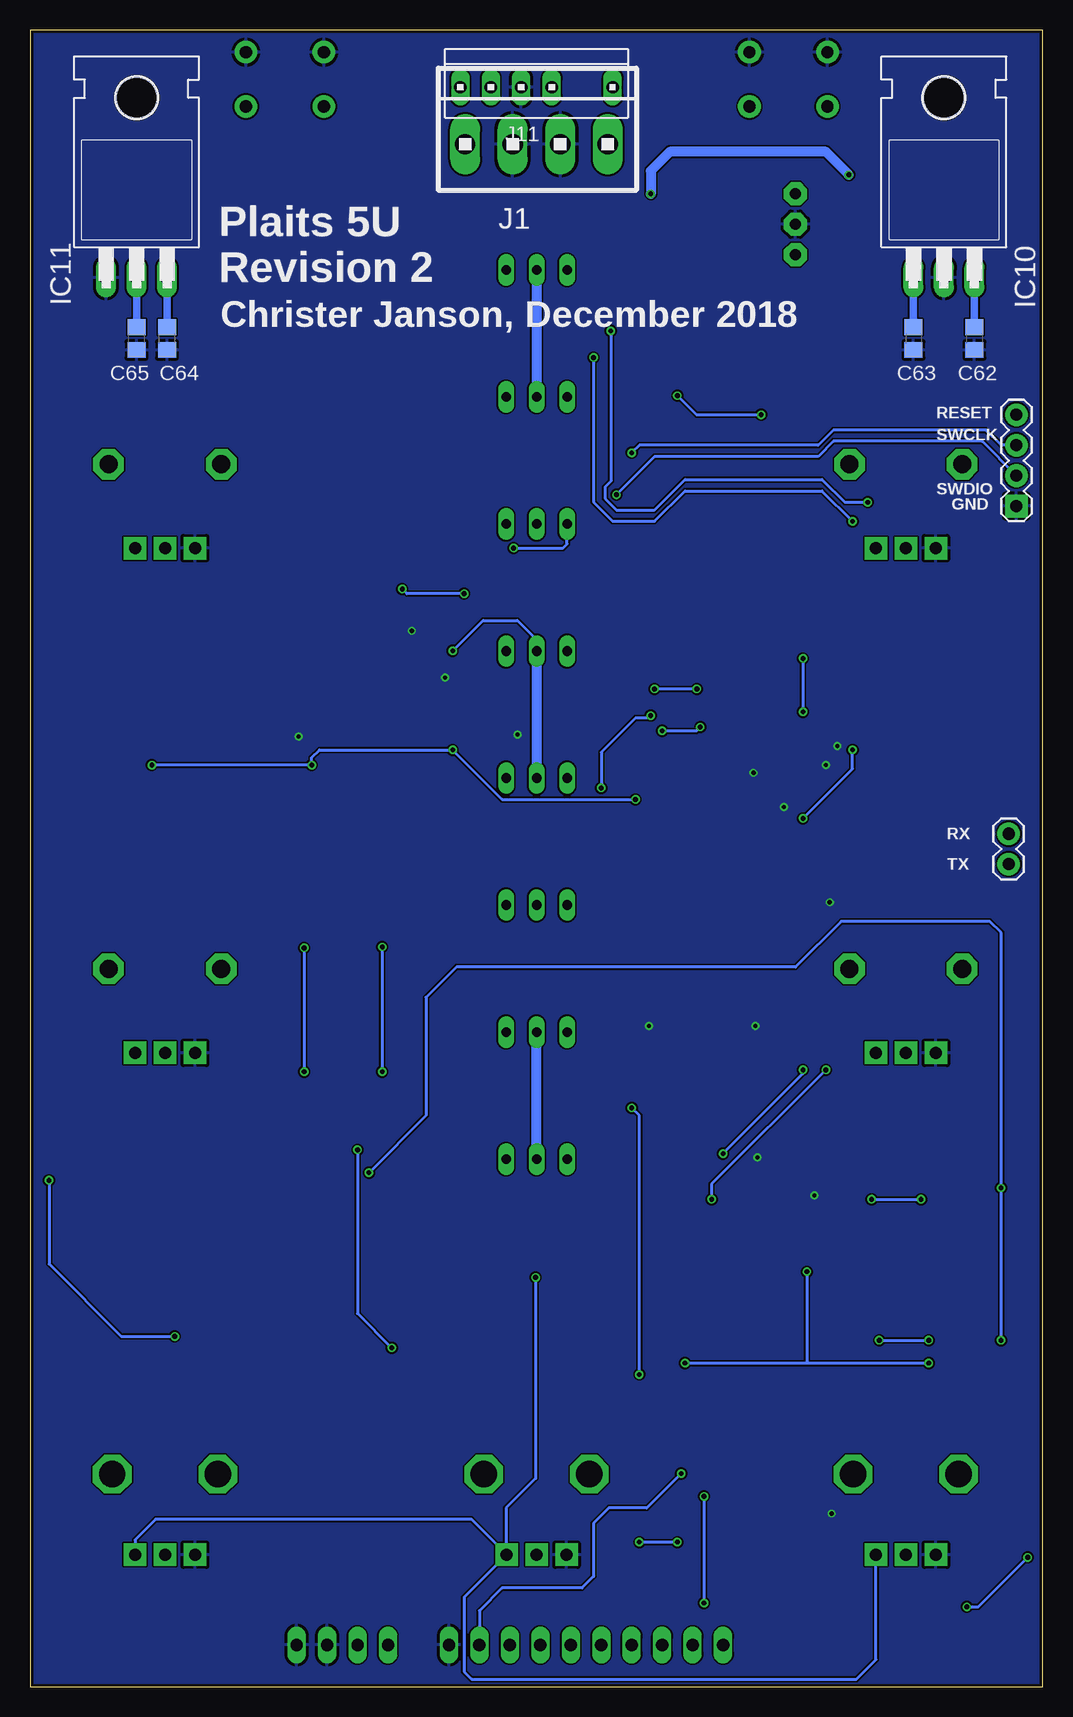
[diagram p6: board, bottom side, seen from below]

Size 84.44 x 138.11 mm. Coordinates in mm from the lower left corner, seen from the top.
Outline: 84.44,0 0,0 0,138.11 84.44,138.11 84.44,0
Copper layers (1*16): Top 0.035mm / dielectric 1.5mm / Bottom 0.035mm
Design rules "SeeedStudio_2layer_DRU_no_angle_20140221": minimum track width 6mil, minimum drill 12mil, track to track 6mil, track to pad 6mil, pad to pad 6mil, via to via 6mil, smd to smd 0mil, copper to edge 10mil, drill to drill 10mil, minimum pad ring 10mil, minimum via ring 6mil, stop-mask expansion 2mil, vias tented up to drill 100mil, thermal gap 10mil

### Footprints (pad centres in the part's own frame; a part is rotated, then mirrored left to right if it is on the bottom)
C1206 = smd 1.6 x 1.8: 1 -1.4,0; 2 1.4,0
PANASONIC_A = smd 2 x 1.5: + 1.3,0; - -1.3,0
PANASONIC_B = smd 2.2 x 1.4: + 1.6,0; - -1.6,0
C0805 = smd 1.3 x 1.5: 1 -0.95,0; 2 0.95,0
SOD123 = smd 1.4 x 1.4: A 1.9,0; C -1.9,0
SOT23 = smd 1 x 1.4: 1 -0.95,-1.1; 2 0.95,-1.1; 3 0,1.1
WE78 = drill 0.9 pad 1.93 octagon: 1 -2.54,0; 2 0,0; 3 2.54,0
TSSOP24_0635 = smd 0.33 x 1: 1 -3.493,-2.725; 2 -2.857,-2.725; 3 -2.223,-2.725; 4 -1.587,-2.725; 5 -0.953,-2.725; 6 -0.318,-2.725; 7 0.318,-2.725; 8 0.953,-2.725; 9 1.587,-2.725; 10 2.223,-2.725; 11 2.857,-2.725; 12 3.493,-2.725; 13 3.493,2.725; 14 2.857,2.725; 15 2.223,2.725; 16 1.587,2.725; 17 0.953,2.725; 18 0.318,2.725; 19 -0.318,2.725; 20 -0.953,2.725; 21 -1.587,2.725; 22 -2.223,2.725; 23 -2.857,2.725; 24 -3.493,2.725
SOT89 = smd 1 x 1.5: 1 -1.499,-1.981; 3 1.499,-1.981 | smd 1 x 2: 2 0,-1.727 | smd 2 x 2: 2@1 0,1.194
LQFP48 = smd 0.254 x 1: 1 -2.75,-4.25; 2 -2.25,-4.25; 3 -1.75,-4.25; 4 -1.25,-4.25; 5 -0.75,-4.25; 6 -0.25,-4.25; 7 0.25,-4.25; 8 0.75,-4.25; 9 1.25,-4.25; 10 1.75,-4.25; 11 2.25,-4.25; 12 2.75,-4.25; 25 2.75,4.25; 26 2.25,4.25; 27 1.75,4.25; 28 1.25,4.25; 29 0.75,4.25; 30 0.25,4.25; 31 -0.25,4.25; 32 -0.75,4.25; 33 -1.25,4.25; 34 -1.75,4.25; 35 -2.25,4.25; 36 -2.75,4.25 | smd 1 x 0.254: 13 4.25,-2.75; 14 4.25,-2.25; 15 4.25,-1.75; 16 4.25,-1.25; 17 4.25,-0.75; 18 4.25,-0.25; 19 4.25,0.25; 20 4.25,0.75; 21 4.25,1.25; 22 4.25,1.75; 23 4.25,2.25; 24 4.25,2.75; 37 -4.25,2.75; 38 -4.25,2.25; 39 -4.25,1.75; 40 -4.25,1.25; 41 -4.25,0.75; 42 -4.25,0.25; 43 -4.25,-0.25; 44 -4.25,-0.75; 45 -4.25,-1.25; 46 -4.25,-1.75; 47 -4.25,-2.25; 48 -4.25,-2.75
SSOP20 = smd 1.422 x 0.356: 1 -2.845,2.936; 2 -2.845,2.276; 3 -2.845,1.615; 4 -2.845,0.98; 5 -2.845,0.32; 6 -2.845,-0.315; 7 -2.845,-0.98; 8 -2.845,-1.615; 9 -2.845,-2.276; 10 -2.845,-2.936; 11 2.845,-2.936; 12 2.845,-2.276; 13 2.845,-1.615; 14 2.845,-0.98; 15 2.845,-0.315; 16 2.845,0.32; 17 2.845,0.98; 18 2.845,1.615; 19 2.845,2.276; 20 2.845,2.936
SO14 = smd 0.6 x 2.2: 1 -3.81,-2.6; 2 -2.54,-2.6; 3 -1.27,-2.6; 4 0,-2.6; 5 1.27,-2.6; 6 2.54,-2.6; 7 3.81,-2.6; 8 3.81,2.6; 9 2.54,2.6; 10 1.27,2.6; 11 0,2.6; 12 -1.27,2.6; 13 -2.54,2.6; 14 -3.81,2.6
SO08 = smd 0.6 x 2.2: 1 -1.905,-2.6; 2 -0.635,-2.6; 3 0.635,-2.6; 4 1.905,-2.6; 5 1.905,2.6; 6 0.635,2.6; 7 -0.635,2.6; 8 -1.905,2.6
DBZ_R-PDSO-G3 = smd 0.7 x 1: 1 -0.95,-1.1; 2 0.95,-1.1; 3 0,1.1
TO220H = drill 1.118 long: 1 -2.54,-10.16; 2 0,-10.16; 3 2.54,-10.16 | hole 3.302: 0,4.826
1X4MTA = drill 1.676 long: 1 5.944,0; 2 1.981,0; 3 -1.981,0; 4 -5.944,0
DOTCOMPOWER = drill 1.016 long: 1 6.35,0; 3 1.27,0; 4 -1.27,0; 5 -3.81,0; 6 -6.35,0
1X02 = drill 1.016 pad 1.88: 1 0,0; 2 2.54,0
1X04 = drill 1.016 pad 1.88 square: 1 0,0 | drill 1.016 pad 1.88: 2 2.54,0; 3 5.08,0; 4 7.62,0
L2012C = smd 0.9 x 1.25: 1 -0.9,0; 2 1,0
0805 = smd 1.2 x 1: 1 -1.1,0; 2 1.1,0
DUOLED-A-5MM = drill 0.813 long: A 0,0; CR 2.54,0; CX -2.54,0
CTS406 = smd 1.9 x 1.4: 1 -2.2,-1.2; 2 2.2,-1.2; 3 2.2,1.2; 4 -2.2,1.2
ALPS_POT_VERTICAL_PS = drill 1 pad 1.88 square: P$1 -2.5,7; P$2 0,7; P$3 2.5,7 | drill 1.5 pad 2.54 octagon: P$4 -4.7,0; P$5 4.7,0
R0805 = smd 1.3 x 1.5: 1 -0.95,0; 2 0.95,0
ALPS_POT_VERTICAL = drill 1 pad 1.88 square: P$1 -2.5,6.7; P$2 0,6.7; P$3 2.5,6.7 | drill 2.2 pad 3.175 octagon: P$4 -4.4,0; P$5 4.4,0
MA04-1 = drill 1.016 long: 1 -3.81,0; 2 -1.27,0; 3 1.27,0; 4 3.81,0
MA10-1 = drill 1.016 long: 1 -11.43,0; 2 -8.89,0; 3 -6.35,0; 4 -3.81,0; 5 -1.27,0; 6 1.27,0; 7 3.81,0; 8 6.35,0; 9 8.89,0; 10 11.43,0
TACTILE-PTH = drill 1.016 pad 1.88: 1 -3.251,2.261; 2 3.251,2.261; 3 -3.251,-2.261; 4 3.251,-2.261

### Placement (x,y rotation side)
C1  30.46,117.32 270 top
C2  33.16,117.32 270 top
C3  30.46,111.44 270 top
C4  55.54,119.06 180 top
C5  61.89,119.06 180 top
C6  33.95,111.44 90 top
C7  52.69,111.28 180 top
C8  51.57,104.3 90 top
C9  20.14,97.63 180 top
C10  20.14,93.82 180 top
C11  11.41,90.49 270 top
C12  73.32,90.49 270 top
C13  79.36,87.95 0 top
C14  6.65,88.58 180 top
C15  18.08,88.74 270 top
C16  55.54,89.38 180 top
C17  52.68,86.36 0 top
C18  57.45,86.36 0 top
C19  15.86,81.12 90 top
C20  18.08,81.12 90 top
C21  6.65,78.42 0 top
C22  77.45,77.15 180 top
C23  31.41,69.53 90 top
C24  31.41,65.33 270 top
C25  23.16,66.36 270 top
C26  25.54,66.36 270 top
C27  51.41,76.52 270 top
C28  59.67,75.25 0 top
C29  54.27,73.03 0 top
C30  58.72,71.28 90 top
C31  54.27,70.48 180 top
C32  11.41,48.26 270 top
C33  52.21,65.09 90 top
C34  73.16,48.74 270 top
C35  61.58,65.09 90 top
C36  11.73,43.18 180 top
C37  78.09,38.42 0 top
C38  6.33,38.1 90 top
C39  17.76,37.78 90 top
C40  37.45,38.1 90 top
C41  48.88,37.94 90 top
C42  67.61,36.2 90 top
C43  79.04,33.97 90 top
C44  36.02,34.13 180 top
C45  67.61,31.11 270 top
C46  6.33,31.75 270 top
C47  18.08,31.75 270 top
C48  37.45,30.16 270 top
C49  48.88,33.18 270 top
C50  61.1,29.84 180 top
C51  35.38,11.11 270 top
C52  66.02,10.48 270 top
C53  18.39,10.48 90 top
C62  5.7,112.4 270 bottom
C63  10.78,112.4 270 bottom
C64  73.01,112.4 90 bottom
C65  75.55,112.4 90 bottom
D1  30.14,133.35 90 top
D2  54.59,133.03 90 top
D3  37.13,49.05 90 top
IC1  20.62,121.92 270 top
IC2  55.07,97 0 top
IC3  77.61,83.18 0 top
IC4  31.41,81.28 270 top
IC5  56.81,80.65 90 top
IC6  12.04,34.29 270 top
IC7  43,34.13 270 top
IC8  73.64,33.97 270 top
IC9  58.56,34.29 0 top
IC10  8.24,127.64 0 bottom
IC11  75.55,127.64 0 bottom
J1  42.21,128.59 0 bottom
J11  42.21,133.35 0 bottom
JP5  2.84,71.12 270 bottom
JP6  2.2,98.42 90 bottom
L1  31.73,121.92 180 top
L2  51.41,120.17 90 top
L3  66.02,120.17 90 top
L4  48.56,111.12 270 top
L5  79.36,90.8 0 top
LD1  42.19,118.12 180 top
LD2  42.19,107.53 180 top
LD3  42.19,96.94 180 top
LD4  42.19,86.35 180 top
LD5  42.19,75.76 180 top
LD6  42.19,65.17 180 top
LD7  42.19,54.58 180 top
LD8  42.19,43.99 180 top
Q1  6.6,83.51 90 top
R1  11.41,101.92 180 top
R2  73.18,101.92 180 top
R3  55.07,103.98 0 top
R4  20.14,106.05 180 top
R5  12.05,84.93 180 top
R6  12.04,82.39 180 top
R7  11.41,59.85 180 top
R8  73.18,59.85 180 top
R9  7.6,71.12 0 top
R10  7.6,68.58 0 top
R11  55.07,65.09 90 top
R12  58.56,65.09 90 top
R13  54.11,47.47 90 top
R14  23.79,41.59 0 top
R15  31.09,38.42 180 top
R16  73.32,38.42 180 top
R17  3.47,38.1 270 top
R18  20.62,37.78 270 top
R19  34.9,38.1 270 top
R20  51.41,37.94 270 top
R21  62.21,36.2 90 top
R22  64.75,36.2 270 top
R23  31.09,35.88 180 top
R24  3.79,45.72 270 top
R25  6.97,45.72 270 top
R26  23.48,37.78 90 top
R27  54.11,42.7 270 top
R28  81.9,33.97 270 top
R29  31.09,32.07 180 top
R30  3.47,26.04 90 top
R31  3.47,31.75 90 top
R32  20.62,31.75 90 top
R33  23.48,33.34 90 top
R34  34.9,30.16 90 top
R35  51.41,33.18 90 top
R36  54.11,37.94 90 top
R37  64.75,31.11 90 top
R38  31.09,29.37 0 top
R39  54.11,33.18 270 top
R40  3.47,21.59 270 top
R41  23.48,28.89 270 top
R42  11.41,17.73 180 top
R43  42.19,17.73 180 top
R44  73.18,17.73 180 top
SV1  58.4,3.49 0 top
SV2  38.08,3.49 0 top
SW1  21.2,134 0 top
SW2  63.18,134 0 top

### Tracks (layer width: path | path; a pad name or v marks a point on that pad's centre or on a via)
+3V3  (via drill 0.4)
  Top 0.254: 29.86,110.14 30.46,109.54 v30.46,107.63 | v23.48,106.04 R4.1 C9.1 | C9.1 | 42.19,108.25 LD2.A | C9.1 C10.1 | C10.1 | C10.1 28.66,86.25 IC4.48 28.66,84.48 28.16,83.98 | 28.16,83.98 28.11,84.03 IC4.1 | 28.16,83.98 28.84,83.3 v28.84,83.18 | v32.36,83.18 30.66,81.48 IC4.17 30.66,75.61 25.54,70.49 C26.1 C25.1 | 55.86,83.46 55.86,82.87 55.68,82.69 55.68,82.65 55.5,82.47 54.23,82.47 53.88,82.83 IC5.20 51.73,85.63 C17.1 | 55.86,83.46 IC5.17 | C16.+ 52.21,89.38 51.73,88.9 C17.1 | 39.03,52.39 38.23,51.58 D3.2 | C17.1 v49.19,86.36 | 55.86,83.46 55.86,84.45 56.42,85.01 59.11,85.01 59.75,84.38 IC5.11
  Top 0.813: IC1.3 29.86,110.14 C3.+ 30.81,110.49 C6.1 39.35,105.09 42.19,105.09 | LD2.A 42.19,105.09 | 42.19,105.09 LD3.A LD4.A | L4.2 43.96,110.03 42.19,108.25 | LD5.A 38.08,71.65 38.08,62.86 | LD7.A 42.19,53.32 41.25,52.39 39.03,52.39 38.08,53.34 38.08,62.86 | LD6.A 42.19,63.8 41.25,62.86 38.08,62.86
  Bottom 0.254: v30.46,107.63 28.87,106.04 v23.48,106.04 | v28.84,83.18 v32.36,83.18 | v49.19,86.36 46.65,88.9 43.79,88.9 42.19,87.3 LD4.A
  Bottom 0.813: LD1.A LD2.A | LD4.A LD5.A | LD8.A LD7.A
+3V3_A  (via drill 0.4)
  Top 0.254: R1.P$1 13.95,94.88 13.95,88.58 12.68,87.31 10.14,87.31 9.51,87.95 9.51,89.85 8.87,90.49 4.11,90.49 3.15,89.53 3.15,76.52 3.79,75.88 14.9,75.88 15.86,76.83 v15.86,78.11 C19.1 C20.1 18.22,80.03 IC4.9 28.54,80.03 v28.55,80.01 | 34.16,77.9 32.36,79.69 v31.73,79.69 | 34.16,77.9 IC4.24 34.16,74.19 v33.95,73.98 33.95,69.53 33,68.58 C23.1 | IC4.25 34.27,78.53 34.27,78 34.16,77.9 | IC6.4 10.78,34.29 | 10.78,34.29 11.41,34.93 11.41,40.32 12.68,41.59 C36.1 13.91,44.41 R7.P$1 13.91,66 15.11,67.2 17.54,67.2 19.35,69 19.35,71.75 v19.98,72.39 | R42.P$1 13.91,13.37 11.41,15.88 11.41,33.66 10.78,34.29 | C44.1 IC7.4 v42.29,34.13 | 76.15,81.16 C22.+ 76.01,77.01 75.83,76.83 | 76.15,81.16 IC3.1 | R2.P$1 75.68,82.73 76.18,82.23 76.18,81.19 76.15,81.16 | C30.+ 58.85,72.71 58.72,72.83 C28.1 | R8.P$1 75.68,76.69 75.83,76.83 | C28.1 58.43,75.54 IC5.8 | IC5.1 51.75,77.8 C27.1 | C27.1 | C28.1 60.31,76.83 v60.94,76.83 | v49.19,78.11 49.83,77.47 C27.1 | v74.28,76.83 75.83,76.83 | C24.1 C23.1 | C23.1
  Bottom 0.254: v31.73,79.69 28.87,79.69 v28.55,80.01 | v19.98,72.39 15.86,76.52 v15.86,78.11 | v42.29,34.13 42.29,17.38 44.75,14.92 44.75,11.08 | 44.75,11.08 R43.P$1 48.24,7.48 48.24,1.27 47.6,0.63 15.54,0.63 13.91,2.26 R42.P$1 | v33.95,73.98 45.06,73.98 v49.19,78.11 60.3,78.11 60.94,77.47 v60.94,76.83 v74.28,76.83 | 44.75,11.08 47.64,13.97 73.96,13.97 75.68,12.24 R44.P$1
ADC_FM
  Top 0.254: IC4.22 33.16,74.85 29.82,71.52 29.82,45.09 34.9,40 R19.1 C40.2 38.08,39.05 39.19,37.94 IC7.1
ADC_GATE
  Top 0.254: IC6.14 16.17,38.1 16.8,38.73 C39.2 R18.1 20.62,42.54 23.48,45.4 27.76,45.4 29.27,46.91 29.27,71.6 32.68,75.01 32.68,77.01 IC4.21
ADC_HARMONICS
  Top 0.254: R20.1 C41.2 46.55,38.89 IC7.14 45.6,39.15 44.75,40 40.94,40 38.4,42.54 36.81,42.54 33,46.36 33,48.89 35.86,51.75 35.86,75.88 37.45,77.47 37.45,79.06 36.47,80.03 IC4.28
ADC_MODEL  (via drill 0.4)
  Top 0.254: R31.1 C46.2 6.65,30.48 IC6.7 9.45,28.95 v9.51,28.89 | IC4.19 31.66,75.29 28.25,71.87 28.25,47.32 27.29,46.36 21.83,46.36 14.72,39.25 13.27,39.25 12.57,38.54 12.57,30.62 13.63,29.55 v13.63,28.89
  Bottom 0.254: v13.63,28.89 v9.51,28.89
ADC_MORPH
  Top 0.254: R35.1 C49.2 46.97,30.32 IC7.8 44.91,30.32 44.75,30.16 43.79,31.11 43.79,37.78 42.21,39.37 40.62,39.37 38.4,41.59 36.17,41.59 32.05,45.72 32.05,49.53 35.22,52.71 35.22,76.2 36.92,77.9 36.92,78.94 36.4,79.46 35.73,79.46 IC4.27
ADC_TIMBRE
  Top 0.254: IC4.20 32.16,75.1 28.76,71.7 28.76,47.15 27.44,45.83 22,45.83 14.98,38.81 13.45,38.81 13,38.36 13,30.8 13.32,30.48 IC6.8 17.76,30.48 C47.2 R32.1
ADC_TRIG  (via drill 0.4)
  Top 0.254: R17.1 C38.2 6.97,39.05 7.92,38.1 IC6.1 9.45,40.26 9.82,40.64 v10.14,40.64 | IC4.18 31.16,75.4 27.74,71.97 27.74,47.52 27.08,46.87 21.65,46.87 15.43,40.64 v14.27,40.64
  Bottom 0.254: v14.27,40.64 v10.14,40.64
ADC_V_OCT
  Top 0.254: R34.1 C48.2 39.29,29.21 40.11,30.03 | 40.11,30.03 40.43,30.35 | 40.11,30.03 40.27,30.19 | 40.27,30.19 IC7.7 | IC4.26 36.22,79.03 36.47,78.78 36.47,78.77 36.49,78.74 36.47,78.71 36.47,78.28 36.29,78.1 36.25,78.1 34.67,76.52 34.67,53.1 31.41,49.85 31.41,45.4 35.86,40.96 38.4,40.96 39.35,40 40.62,38.73 41.89,38.73 43.05,37.58 43.05,30.68 42.52,30.16 40.3,30.16 40.27,30.19
AREF_-10  (via drill 0.4)
  Top 0.254: R26.2 24.11,38.73 25.06,37.78 25.06,35.88 R33.2 23.16,34.61 v19.66,34.61 | v3.47,28.89 R30.2 v9.51,26.99 | v3.47,41.59 6.33,41.59 6.97,42.23 R25.2 | R23.2 R29.2 29.51,32.07 28.87,31.43 28.87,27.94 v29.82,26.99 | C50.1 62.21,30.01 62.21,31.43 | 62.21,31.43 62.84,32.07 R37.2 | 62.21,31.43 60.45,33.19 IC9.2 59.51,37.94 58.56,38.89 R36.2 54.11,41.59 | 54.11,41.59 R27.2 | R27.2 | v56.18,42.86 56.18,42.23 55.54,41.59 54.11,41.59
  Bottom 0.254: v3.47,28.89 v3.47,41.59 3.47,62.86 4.43,63.82 16.81,63.82 20.62,60.01 48.88,60.01 51.41,57.47 51.41,47.62 v56.18,42.86 | v9.51,26.99 19.66,26.99 | 19.66,26.99 v29.82,26.99 | v19.66,34.61 19.66,26.99
DAC_BCK
  Top 0.254: IC4.29 39.55,80.53 40.06,81.04 57.16,81.04 58.43,82.32 IC5.13
DAC_DIN
  Top 0.254: IC5.14 57.77,83.47 57.77,82.58 56.72,81.53 IC4.31
DAC_LRCK
  Top 0.254: IC5.15 57.13,82.55 56.62,82.04 35.67,82.04 IC4.32
FM_IN  (via drill 0.4)
  Top 0.254: R15.2 28.24,36.51 28.24,24.54 30.14,22.64 v30.14,17.78
  Bottom 0.254: v30.14,17.78 33,14.92 36.17,14.92 37.45,13.65 37.45,9.52 37.45,9.21 38.4,8.26 45.06,8.26 46.97,6.35 SV2.9
FREQ_ATT  (via drill 0.4)
  Top 0.254: R43.P$2 42.2,11.76 41.25,12.7 36.02,12.7 C51.1 v33.63,12.07 | IC4.15 29.66,76.04 26.13,72.5 23.93,72.5 20.62,69.19 20.62,52.07 v19.98,51.43 | v26.65,44.45 26.65,14.92 29.51,12.07 v30.46,12.07
  Bottom 0.254: v26.65,44.45 19.98,51.12 v19.98,51.43 | v30.46,12.07 v33.63,12.07
FREQ_POT
  Top 0.254: R1.P$2 C11.1 4.11,91.44 2.52,89.85 2.52,76.2 3.47,75.25 15.22,75.25 18.39,78.42 19.98,78.42 21.09,79.53 IC4.10
GATE_IN
  Top 0.254: SV2.4 34.27,6.03 30.78,9.52 25.7,14.61 25.7,40.64 R14.2
GATE_IN1  (via drill 0.4)
  Top 0.254: SV2.2 26.02,6.67 v6.33,6.67 | v1.25,10.8 1.25,43.5 2.52,44.77 R24.2
  Bottom 0.254: v6.33,6.67 5.38,6.67 v1.25,10.8
GND  (via drill 0.35)
  Top 0.254: IC4.23 33.66,74.7 31.42,72.46 31.42,70.49 C23.2 | IC5.16 56.49,84.44 56.65,84.6 58.89,84.6 59.11,84.38 59.09,84.35 IC5.12
  other vias: 18.08,76.83 24.11,76.2 21.57,73.34 17.76,65.41 17.12,78.42 43.79,79.38 49.83,84.14 19.03,40.96 23.79,44.13 52.61,88.03 62.05,79.22 23.95,55.09 32.84,55.09 17.6,14.45
  pour Top: 84.44,138.11 84.44,0 -0.02,0 -0.02,138.11
  pour Bottom: 84.44,138.11 84.44,0 -0.02,0 -0.02,138.11
HARMONICS_IN  (via drill 0.4)
  Top 0.254: R13.2 57.13,45.4 v57.13,44.77 | SV2.8 44.43,6.35 54.27,16.19 v54.27,28.26
  Bottom 0.254: v57.13,44.77 57.13,31.11 v54.27,28.26
HARMONICS_POT  (via drill 0.4)
  Top 0.254: v36.02,113.03 36.02,118.27 36.17,118.43 36.22,118.43 39.42,121.63 45.92,121.63 50.71,116.84 58.08,116.84 73.18,101.74 R2.P$2 73.32,94.78 C12.1 | v14.59,98.74 8.24,98.74 3.87,94.38 3.87,92.55 1.25,89.93 1.25,75.57 2.84,73.98 17.28,73.98 21.84,78.53 IC4.12
  Bottom 0.254: v36.02,113.03 36.02,100.49 36.49,100.01 36.49,99.06 35.54,98.11 32.36,98.11 29.82,100.65 18.39,100.65 16.49,98.74 v14.59,98.74
LEDS_SCK
  Top 0.254: IC4.33 45.36,82.53 47.6,84.77 47.6,87.63 52.84,92.87 IC2.3
LEDS_SIN
  Top 0.254: IC4.35 40.32,83.53 40.58,83.27 45.42,83.27 46.96,84.81 46.96,87.94 52.21,93.19 IC2.2
LEDS_SS  (via drill 0.4)
  Top 0.254: IC4.36 40.43,84.03 40.76,83.71 45.24,83.71 46.45,84.91 46.45,89.33 v48.24,91.12 | v53.4,91.52 53.48,91.6 IC2.4
  Bottom 0.254: v48.24,91.12 53,91.12 v53.4,91.52
MODEL_IN
  Top 0.254: SV2.1 6.01,3.49 3.47,6.03 3.47,18.73 R40.2
MORPH_ATT  (via drill 0.4)
  Top 0.254: C52.1 66.18,11.59 | 66.18,11.59 67.61,13.02 72.37,13.02 73.18,12.2 R44.P$2 | IC4.14 29.09,76.96 29.09,76.13 25.99,73.03 23.16,73.03 19.98,69.85 19.98,53.34 v18.08,51.43 | v27.6,40.64 27.6,24.57 28.24,23.93 v28.24,15.88 | v28.24,6.98 30.46,4.76 30.46,2.22 31.73,0.95 49.83,0.95 50.78,1.9 50.78,8.89 53.32,11.43 C52.1 66.18,11.59
  Bottom 0.254: v18.08,51.43 27.6,41.91 v27.6,40.64 | v28.24,15.88 v28.24,6.98
MORPH_IN
  Top 0.254: SV2.6 39.35,5.4 41.25,7.3 43.79,7.3 52.05,15.56 52.05,28.26 54.11,30.32 R39.2
MORPH_POT  (via drill 0.4)
  Top 0.254: v37.45,110.81 37.45,119.04 39.6,121.2 45.74,121.2 50.73,116.2 57.76,116.2 65.7,108.27 65.7,93.03 73.18,85.55 R8.P$2 73.16,52.83 C34.1 | v15.86,97.15 7.6,97.15 4.43,93.98 4.43,92.39 1.89,89.85 1.89,75.88 3.15,74.61 17.1,74.61 21.52,79.03 IC4.11
  Bottom 0.254: v37.45,110.81 37.45,98.74 35.86,97.15 32.36,97.15 29.82,99.7 18.39,99.7 v15.86,97.15
N$1
  Top 0.813: IC1.1 26.36,118.72 C1.1 30.73,118.99 L1.2
N$2
  Top 0.254: IC2.12 59.38,93.45 59.39,93.45 65.54,87.3 65.54,56.36 61.57,52.39 47.92,52.39 44.73,49.2 LD8.CX
N$4
  Top 0.254: IC6.2 7.6,36.83 7.28,37.15 C38.1 R17.2 2.52,37.15 1.89,37.78 1.89,42.23 2.52,42.86 4.74,42.86 5.38,43.5 5.38,46.36 | 5.38,46.36 5.69,46.67 R25.1 | 5.38,46.36 | 5.38,46.36 5.06,46.67 R24.1
N$5
  Top 0.254: IC2.11 57.92,93.19 58.09,93.02 59.21,93.02 64.96,87.27 64.96,56.73 61.26,53.02 47.29,53.02 44.11,49.85 40.62,49.85 39.98,49.21 39.98,44.32 LD8.CR
N$6
  Top 0.254: IC5.2 54.54,75.83 53.32,74.61 C29.1
N$7
  Top 0.254: R5.1 13.47,84.45 19.98,84.45 22.41,82.03 IC4.5
N$8
  Top 0.254: R6.1 13.47,82.39 14.9,83.82 19.03,83.82 21.32,81.53 IC4.6
N$9
  Top 0.254: IC2.10 57.29,92.87 57.57,92.59 59.03,92.59 64.37,87.25 64.37,59.63 63.16,58.42 45.7,58.42 44.75,57.47 44.75,54.59 LD7.CX
N$10
  Top 0.254: IC2.9 56.65,92.55 57.05,92.16 58.85,92.16 63.8,87.22 63.8,60.01 62.84,59.06 40.94,59.06 39.65,57.77 LD7.CR
N$11
  Top 0.254: IC2.8 56.02,91.92 56.21,91.73 58.67,91.73 62.55,87.85 62.55,82.33 59.34,79.12 48.3,79.12 46.65,77.47 46.65,73.66 44.75,71.75 44.75,65.18 LD6.CX
N$12
  Top 0.254: IC2.13 58.55,99.24 54.88,95.57 48.24,95.57 45.94,93.27 45.94,85.01 45.06,84.14 40.94,84.14 39.65,85.42 LD4.CR
N$13
  Top 0.254: IC2.7 55.38,91.92 56,91.29 58.5,91.29 62.12,87.67 62.12,82.51 59.16,79.55 47.46,79.55 46.02,78.11 46.02,73.98 44.75,72.71 41.57,72.71 39.67,70.8 39.67,65.18 LD6.CR
N$14
  Top 0.254: IC2.14 57.92,99.22 54.91,96.2 47.6,96.2 44.73,93.33 LD4.CX
N$15
  Top 0.254: IC2.6 54.75,91.92 55.8,90.86 58.32,90.86 61.69,87.49 61.69,82.69 59.06,80.06 45.75,80.06 44.73,79.04 LD5.CX
N$16
  Top 0.254: IC5.4 55.83,73.63 C29.2
N$17  (via drill 0.4)
  Top 0.254: IC2.15 57.28,99.25 55.18,97.15 47.6,97.15 45.38,94.93 v44.11,94.93
  Bottom 0.254: v44.11,94.93 39.98,94.93 39.65,95.27 LD3.CR
N$18
  Top 0.254: IC2.16 56.65,99.25 55.18,97.79 45.59,97.79 LD3.CX
N$19
  Top 0.254: LD2.CR 38.4,108.78 38.4,119.38 39.78,120.76 45.56,120.76 50.84,115.48 57.49,115.48 58.63,114.34 58.63,102.83 57.17,101.37 56.27,101.37 56.02,101.12 IC2.17
N$20
  Top 0.254: LD2.CX 49.83,102.43 49.83,99.38 50.78,98.42 54.91,98.42 55.38,98.9 IC2.18
N$21
  Top 0.254: LD1.CR 41.87,120.33 45.38,120.33 50.67,115.05 57.31,115.05 58.2,114.16 58.2,103.01 56.99,101.8 55.4,101.8 54.7,101.1 54.7,99.77 IC2.19
N$22
  Top 0.254: IC2.5 54.11,91.92 55.6,90.43 58.14,90.43 61.26,87.31 61.26,82.87 58.96,80.57 41.1,80.57 39.65,79.13 LD5.CR
N$23
  Top 0.254: IC2.20 54.11,101.12 55.22,102.23 56.81,102.23 57.76,103.19 57.76,113.98 57.13,114.62 50.45,114.62 46.95,118.12 LD1.CX
N$27
  Top 0.254: C8.1 IC2.24 | C7.+ 51.38,110.46 | 50.62,103.35 C8.1 | C8.1
  Top 0.813: L4.1 50.63,112.23 51.38,111.47 C7.+ | 51.38,110.46 51.38,109.83 49.51,107.95 49.51,104.46 50.62,103.35
N$28
  Top 0.254: IC6.13 C39.1 R18.2 R26.1 22.21,38.1 22.21,40.95 R14.1
N$29
  Top 0.254: C14.2 5.4,88.28 Q1.3 5.7,85.41 5.7,84.14 6.01,83.82 8.87,83.82 9.98,84.93 R5.2
N$30
  Top 0.254: R38.1 32.04,31.27 R29.1 33.95,32.07 R34.2 C48.1 37.92,31.59 IC7.6
N$31
  Top 0.254: SV2.3 31.73,6.03 23.48,14.29 R41.2
N$32
  Top 0.254: IC7.9 46.81,31.59 47.29,32.07 47.29,33.66 47.76,34.13 C49.1 R35.2 R39.1 | R39.1 | R39.1 R36.1
N$33
  Top 0.254: R10.1 JP5.2
N$34
  Top 0.254: R15.1 32.36,38.42 33.63,37.15 | 33.63,37.15 R19.2 C40.1 38.39,37.15 38.87,36.67 IC7.2 | 33.63,37.15 32.36,35.88 R23.1
N$35
  Top 0.254: Q1.1 7.84,81.35 | 7.84,81.35 8.88,82.39 R6.2 | C21.2 7.84,78.67 7.84,81.35
N$37
  Top 0.254: R40.1 R30.1 2.52,25.08 1.89,25.72 1.89,32.07 2.52,32.7 R31.2 C46.1 6.97,32.7 7.92,31.75 IC6.6
N$38
  Top 0.61: 48.24,130.17 48.24,128.68 J1.4
  Top 0.813: J11.5 46.02,132.4 48.24,130.17 | D2.C 52.13,128.68 48.24,128.68
N$39
  Top 0.254: IC6.9 16.49,31.75 17.44,32.7 C47.1 R32.2 23.16,32.7 R33.1 R41.1
N$40
  Top 0.813: IC11.3 71.42,119.06 70.15,119.06 67.94,121.27 L3.2
  Bottom 0.61: IC11.3 C64.2
N$41
  Top 0.254: IC7.13 48.55,36.67 C41.1 R20.2 52.21,36.99 52.68,37.46 52.68,43.5 53,43.82 54.11,43.82 | R27.1 54.11,43.82 | 54.11,43.82 R13.1
N$42
  Top 0.254: L5.1 78.26,88.25 C13.1 77.95,87.12 79.36,85.73 79.36,81.45 IC3.3
N$43
  Top 0.254: IC5.6 57.13,76.81 57.02,76.7 57.02,67.99 R11.2
N$44  (via drill 0.4)
  Top 0.254: L2.2 50.14,120 50.14,118.43 51.3,117.27 58.26,117.27 80.6,94.93 80.62,94.93 80.62,90.97 L5.2
  Top 0.813: L1.1 32.68,121.97 | IC10.3 4.74,117.48 3.79,116.52 3.79,110.81 5.06,109.54 14.27,109.54 15.54,110.81 15.54,125.41 v16.17,126.05 | L1.1 32.63,119.25 C2.1 37.31,122.87 49.82,122.87 L2.2 | v32.68,124.46 32.68,121.97 | 32.68,121.97 L1.1
  Bottom 0.61: IC10.3 C62.1
  Bottom 0.813: v16.17,126.05 18.08,127.95 31.09,127.95 32.68,126.37 v32.68,124.46
N$45
  Top 0.813: D1.C 29.5,131.45 26.97,133.98 16.17,133.98 14.27,132.08 14.27,119.7 12.04,117.48 IC10.1
  Bottom 0.61: C63.1 IC10.1
N$46  (via drill 0.4)
  Top 0.254: v55.07,61.67 R11.1 C33.1 | v55.07,61.67 | v55.07,51.28 62.21,44.13 R21.2
  Bottom 0.254: v55.07,61.67 v55.07,51.28
N$47  (via drill 0.4)
  Top 0.254: v61.57,61.6 C35.1 R12.1 | v61.57,61.6 | v61.57,51.28 72.37,40.48 R16.2 | R12.1
  Bottom 0.254: v61.57,61.6 v61.57,51.28
N$48
  Top 0.254: IC5.5 56.49,70.8 56.18,70.49 C31.1
N$49
  Top 0.813: J1.1 35.86,128.99 J11.1 33.96,135.25 D1.A
N$50
  Top 0.813: D2.A 55.54,133.98 67.92,133.98 69.2,132.71 69.2,122.87 70.78,121.28 74.91,121.28 75.55,120.65 IC11.2
  Bottom 0.61: IC11.2 C65.2
N$51
  Top 0.254: JP5.1 R9.1
N$54
  Top 0.254: IC5.18 55.2,85.06 C18.1
N$55
  Top 0.254: IC5.7 57.79,76.86 57.45,76.52 57.45,67.94 58.72,66.68 58.56,66.52 R12.2
N$58
  Top 0.254: R28.2 C43.1 78.72,33.34 IC8.6 74.91,33.34 74.27,33.98 R16.1 | R28.2 82.53,33.02 | 82.53,33.02 | 82.53,33.02 R28.2
N$60
  Top 0.254: IC8.7 77.77,34.61 78.08,34.92 C43.2 R28.1 83.16,34.92 83.17,34.93 83.48,34.61 83.48,30.48 81.58,28.57 81.58,8.57 79.99,6.98 58.27,6.98 57.13,5.84 SV1.2
N$62
  Top 0.254: IC8.2 68.25,34.61 C42.1 R22.2 R21.1
N$63
  Top 0.254: R22.1 C42.2 68.88,37.14 69.2,36.83 69.2,36.2 69.51,35.88 IC8.1 72.69,35.88 73.52,35.04 73.52,26.79 74.91,25.4 78.4,25.4 80.31,23.49 80.31,9.21 79.04,7.94 56.81,7.94 54.59,5.71 SV1.1
N$68
  Top 0.254: IC2.23 52.21,101.12 52.68,101.6 53.8,101.6 54.12,101.92 R3.1
NORMALIZATION_PROBE  (via drill 0.4)
  Top 0.254: SV2.5 36.81,5.71 32.68,9.84 32.68,25.08 v33.63,26.04 | v34.27,48.26 35.06,49.05 D3.3 36.81,49.84 v36.81,74.93 | IC4.30 32.75,81.03 v32.68,80.96
  Bottom 0.254: v33.63,26.04 33.63,47.62 v34.27,48.26 | v32.68,80.96 32.88,80.77 33.95,80.77 36.81,77.91 v36.81,74.93
RESET  (via drill 0.4)
  Top 0.254: JP6.4 R4.2 19.19,101.44 17.44,99.7 17.44,90.33 C15.1 19.98,87.79 v19.98,85.73 | v19.98,81.28 20.23,81.03 IC4.7
  Bottom 0.254: v19.98,85.73 v19.98,81.28
RX
  Top 0.254: IC4.46 29.59,85.46 29.59,79.9 27.79,78.1 22.23,78.1 17.68,73.55 17.68,72.31 16.49,71.12 R9.2
SW_1
  Top 0.254: SW1.3 SW1.4 19.91,127.19 18.77,127.19 17.88,126.31 17.88,116.66 31.17,103.37 31.17,85.54 IC4.43
SW_2
  Top 0.254: IC4.42 31.66,103.57 18.39,116.84 18.39,126.05 19.03,126.68 33,126.68 34.59,125.09 53.28,125.09 SW2.3 SW2.4
SWCLK  (via drill 0.4)
  Top 0.254: v34.27,102.87 34.27,85.64 IC4.37
  Bottom 0.254: JP6.3 3.47,103.51 4.74,104.78 17.44,104.78 18.71,103.51 33.63,103.51 v34.27,102.87
SWDIO  (via drill 0.4)
  Top 0.254: v35.54,99.38 35.54,85.41 34.27,84.14 34.27,83.26 34.51,83.03 IC4.34
  Bottom 0.254: JP6.2 5.06,103.82 17.44,103.82 18.71,102.55 32.36,102.55 v35.54,99.38
TIMBRE_ATT
  Top 0.254: R42.P$2 11.41,10.16 12.04,9.53 C53.1 19.67,9.53 20.93,10.8 20.93,23.49 20.3,24.13 13.63,24.13 12.36,25.4 12.36,30.21 12.13,30.44 12.13,39.78 14.59,42.23 15.86,42.23 21.25,47.62 21.25,68.58 24.75,72.07 26.33,72.07 30.14,75.88 30.14,77.01 IC4.16
TIMBRE_POT
  Top 0.254: IC4.13 28.66,76.31 26.97,74.61 20.3,74.61 18.79,73.1 18.79,69.37 17.36,67.94 12.04,67.94 11.41,67.31 R7.P$2 C32.1
TX
  Top 0.254: IC4.45 30.09,85.46 30.09,79.79 27.97,77.67 22.52,77.67 18.19,73.34 18.19,69.65 17.12,68.58 R10.2
V_OCT_IN
  Top 0.254: SV2.7 39.98,1.59 36.17,1.59 35.54,2.22 35.54,6.03 32.04,9.53 R38.2
VCC
  Top 0.254: IC8.8 77.14,36.77 C37.1 77.13,42.86 82.53,48.26 82.53,93.64 58.46,117.7 55.3,117.7 C4.+
  Top 0.61: C4.+ L2.1
VEE  (via drill 0.4)
  Top 0.254: IC8.4 71.04,30.74 70.94,30.64 | 70.94,30.64 70.47,30.16 70.46,30.16 C45.2 R37.1 | 66.01,119.06 66.01,110.77 82.96,93.82 82.96,48.08 82.85,47.97 v82.85,42.23 | v72.37,29.21 70.94,30.64
  Top 0.61: L3.1 66.01,119.06 C5.-
  Bottom 0.254: v82.85,42.23 82.85,35.24 76.81,29.21 v72.37,29.21

### Text on the board
bNames: Plaits 5U | Revision 2 | Christer Janson, December 2018 | RESET | SWCLK | SWDIO | GND | RX | TX
bValues: 7912